# EasyEDA schematic Schematic_Central Unit for AgOpenGPS.json

## Sheets
1 Supply_USB: TITLE: Supply & USB; REV: 1.9; Date: 2020-12-11; Sheet: 1/1; Drawn By: GoRoNb; Company: agopengps.discourse.group
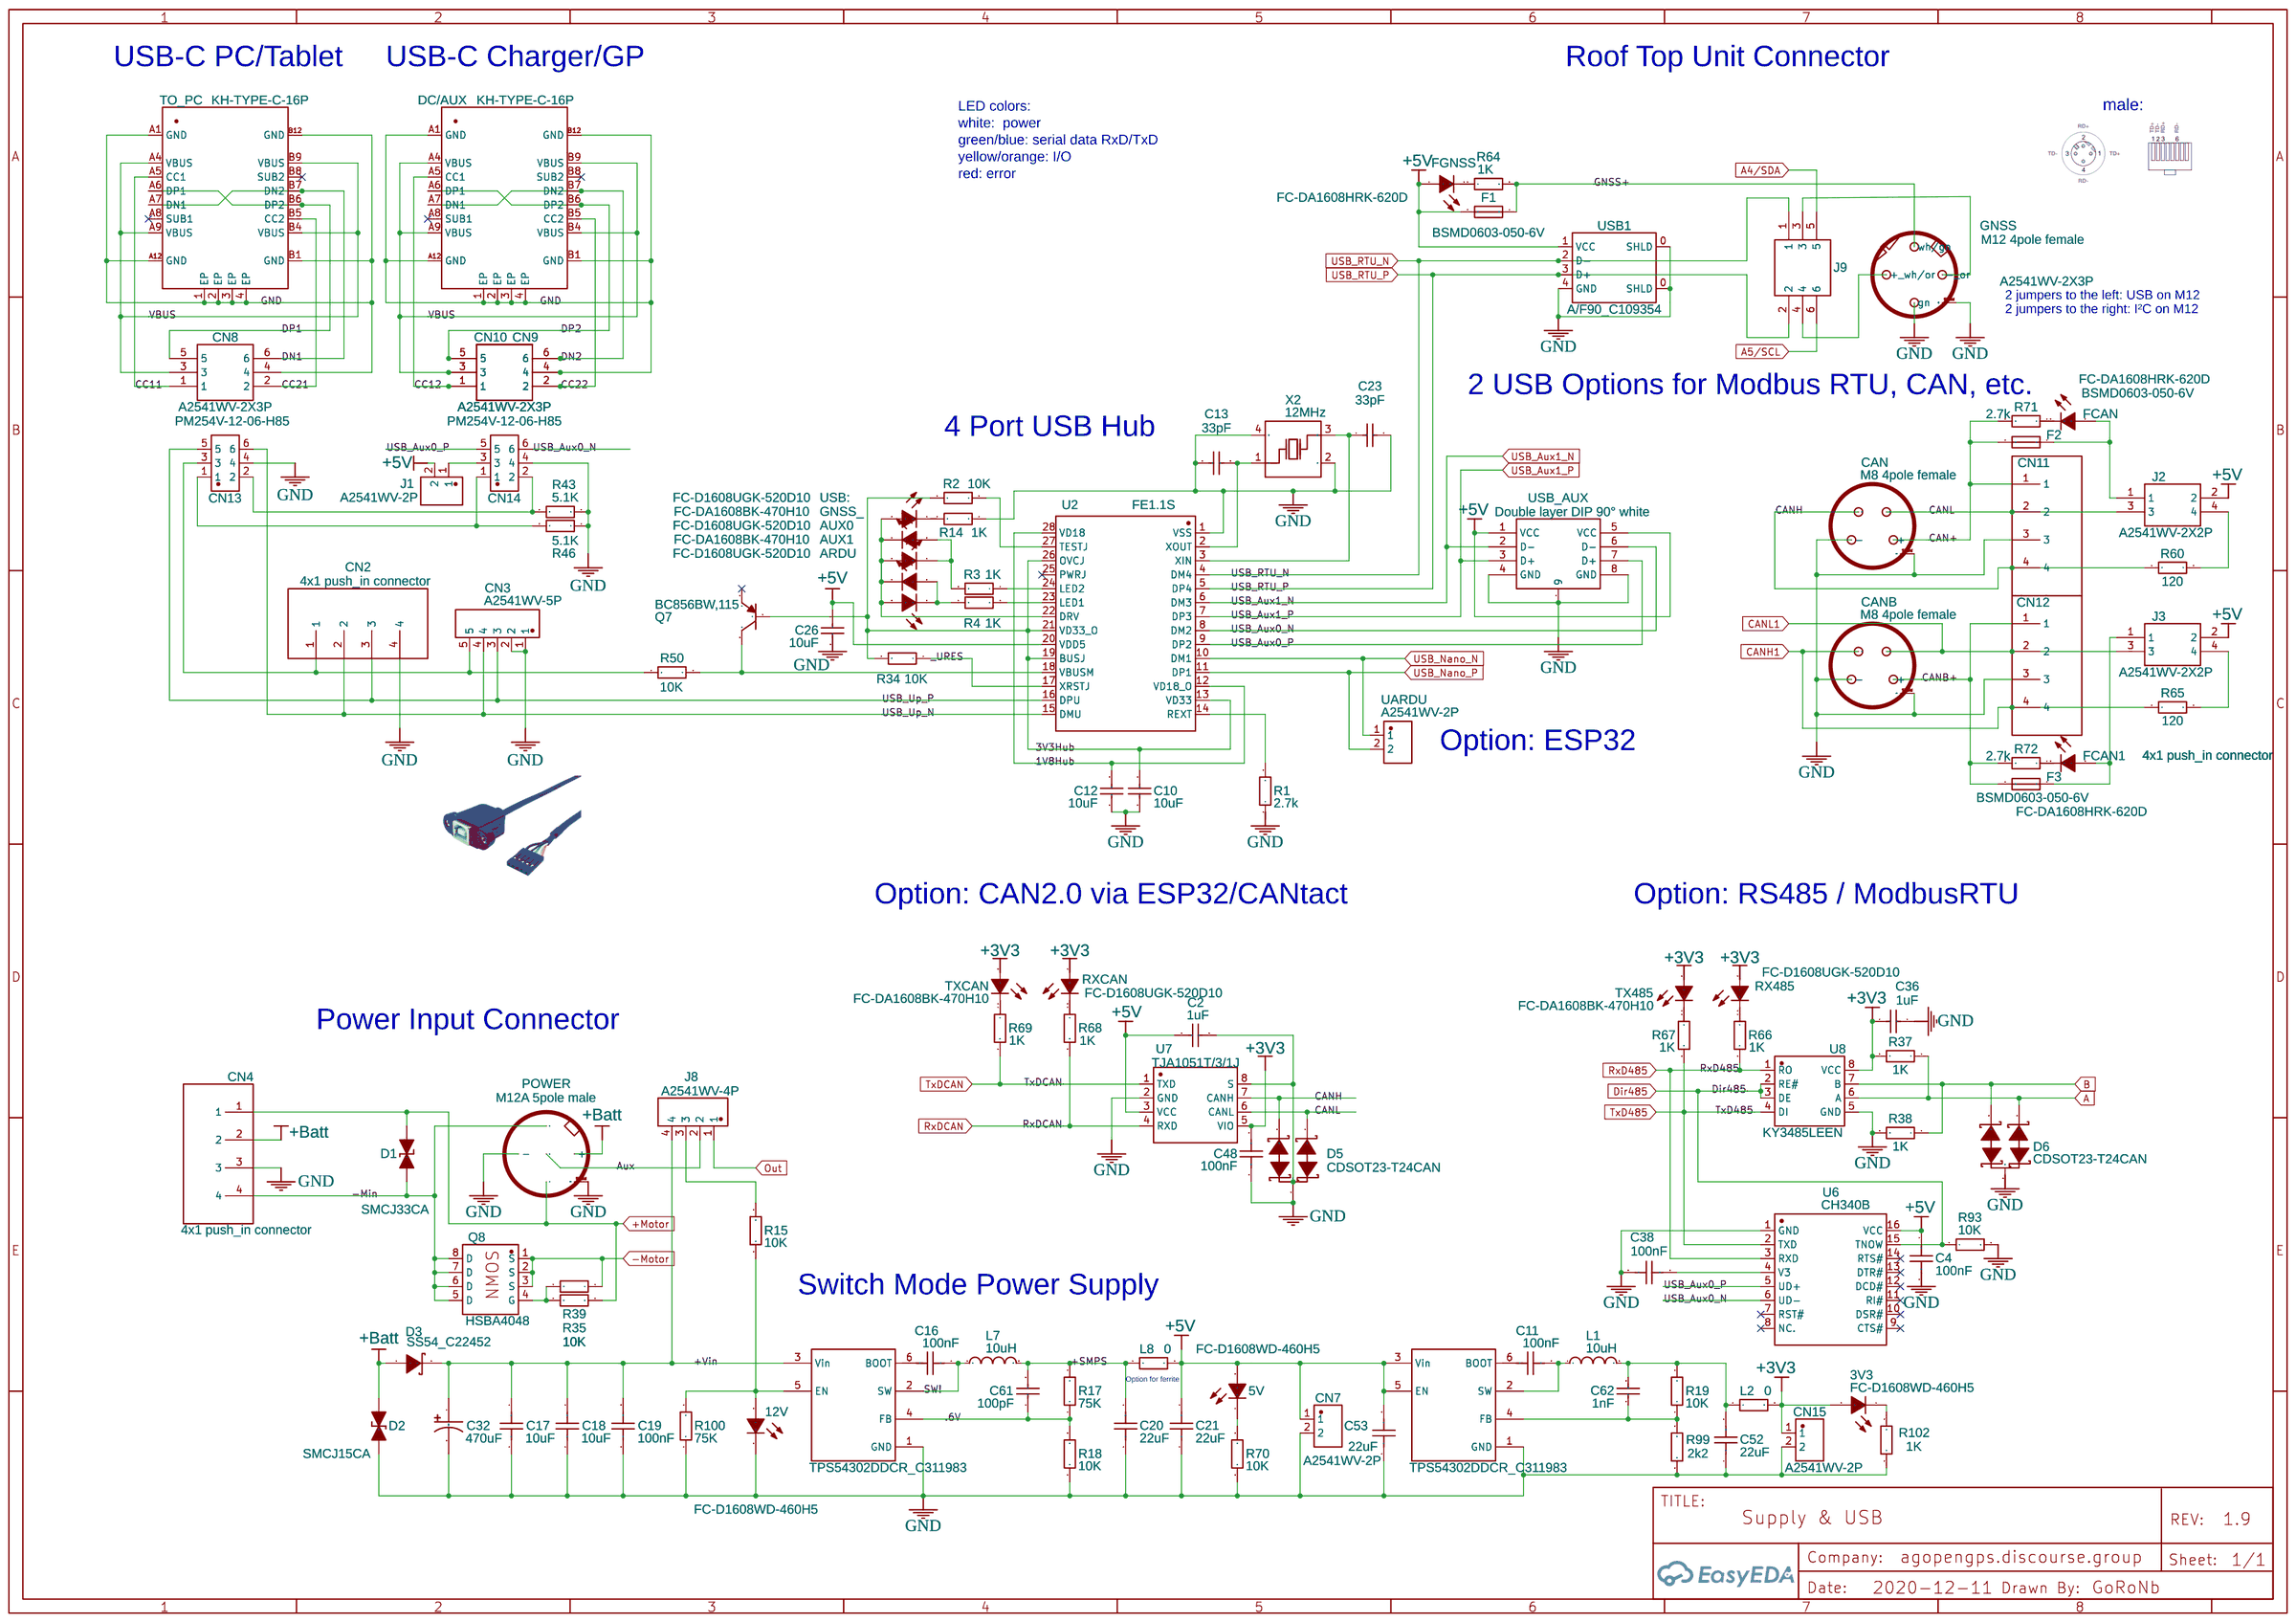
[diagram p0: Supply_USB]
2 Motor control: TITLE: µC, Motor Driver, I/O
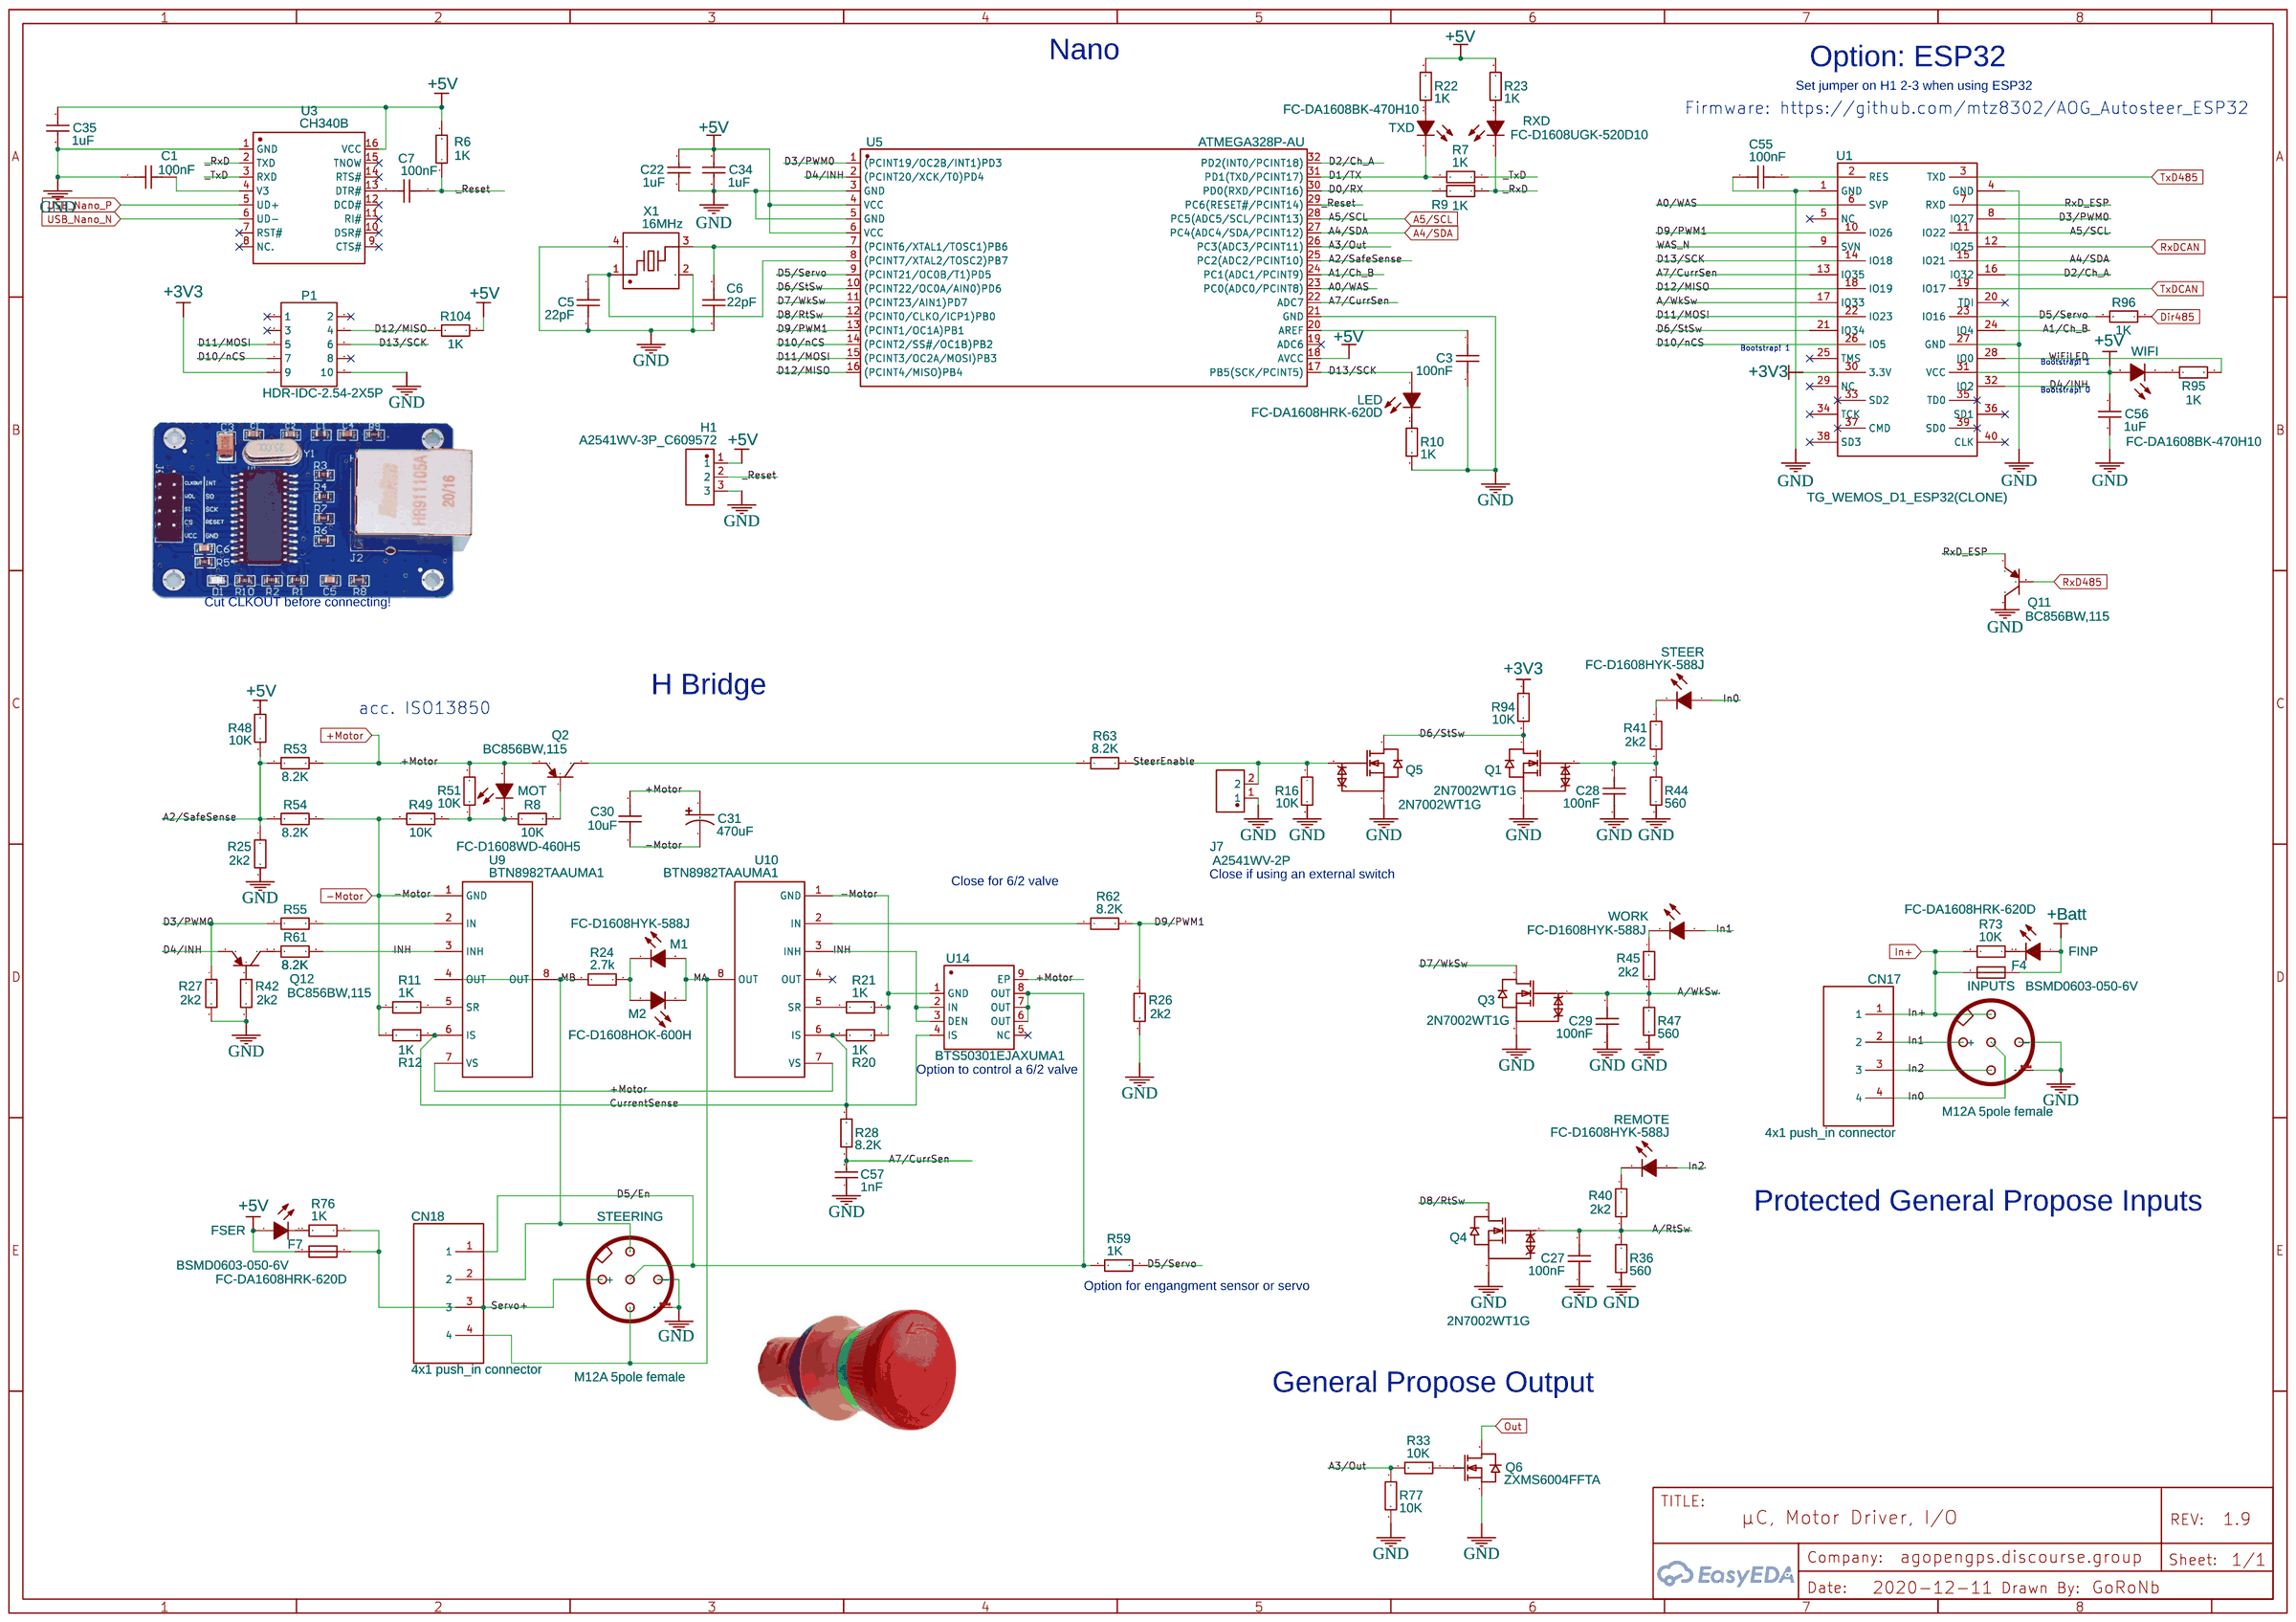
[diagram p1: Motor control]
3 CANtact: TITLE: CANtact controller
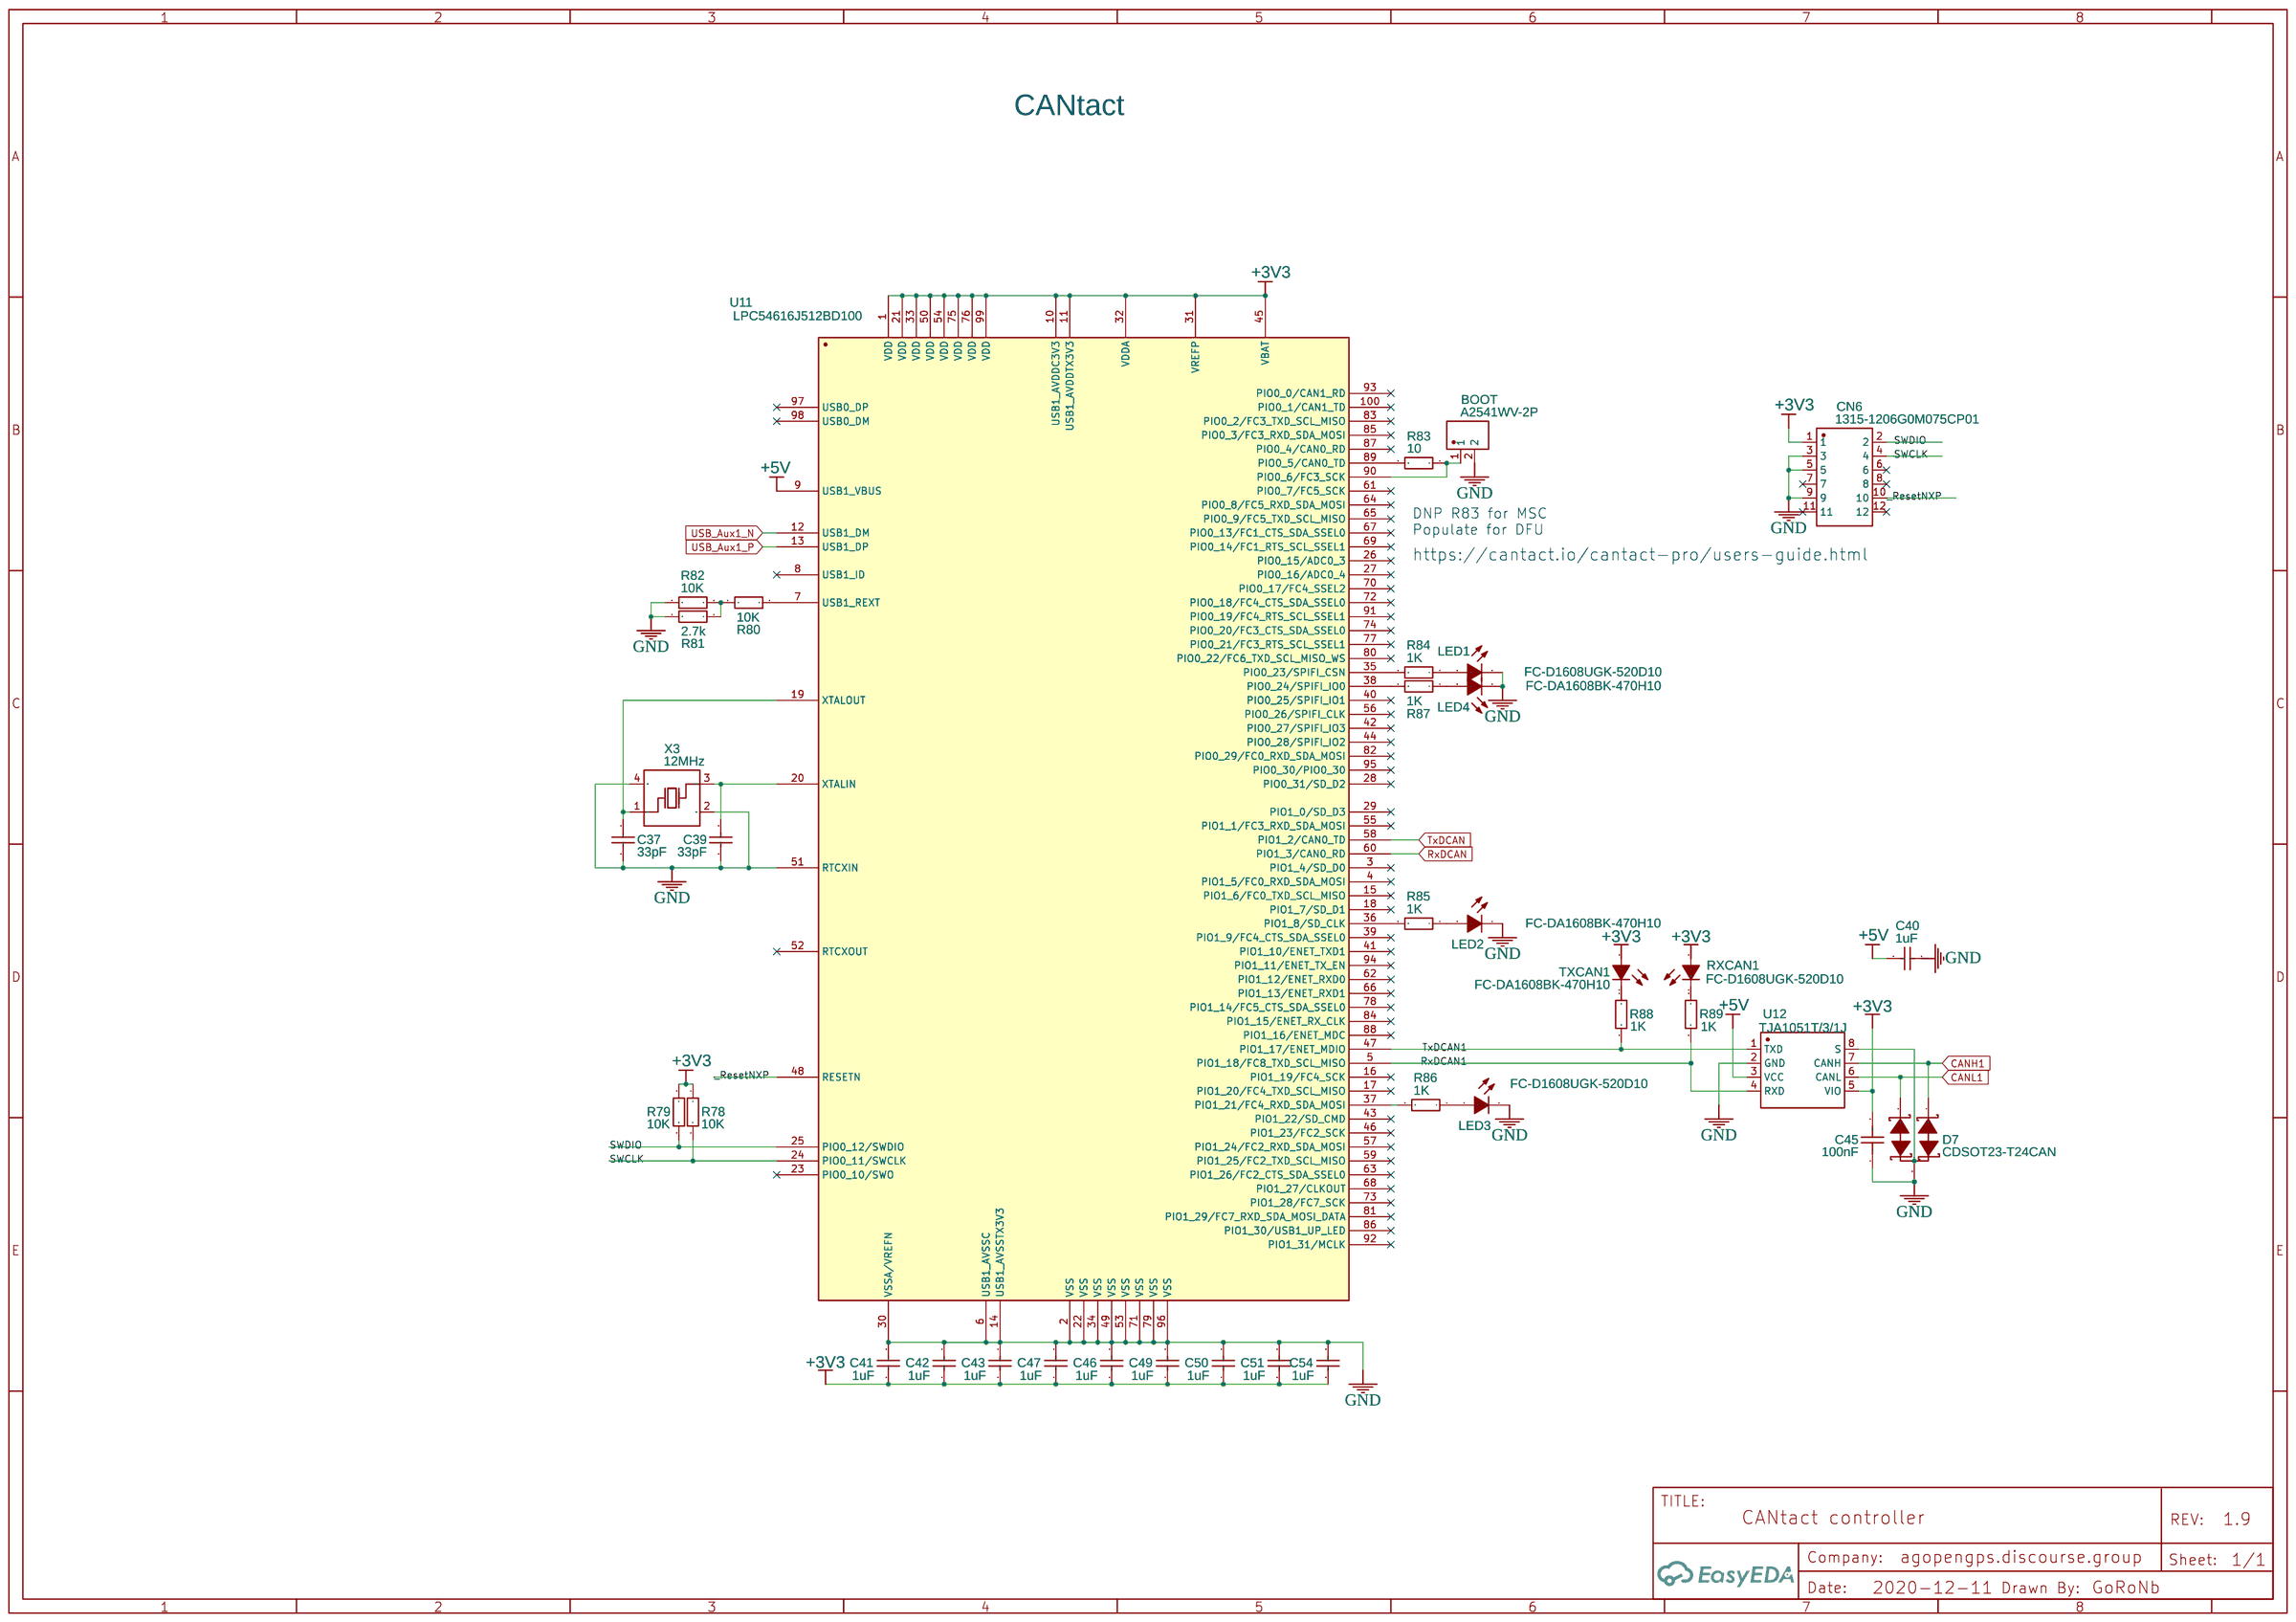
[diagram p2: CANtact]
4 Sensors: TITLE: Sensors
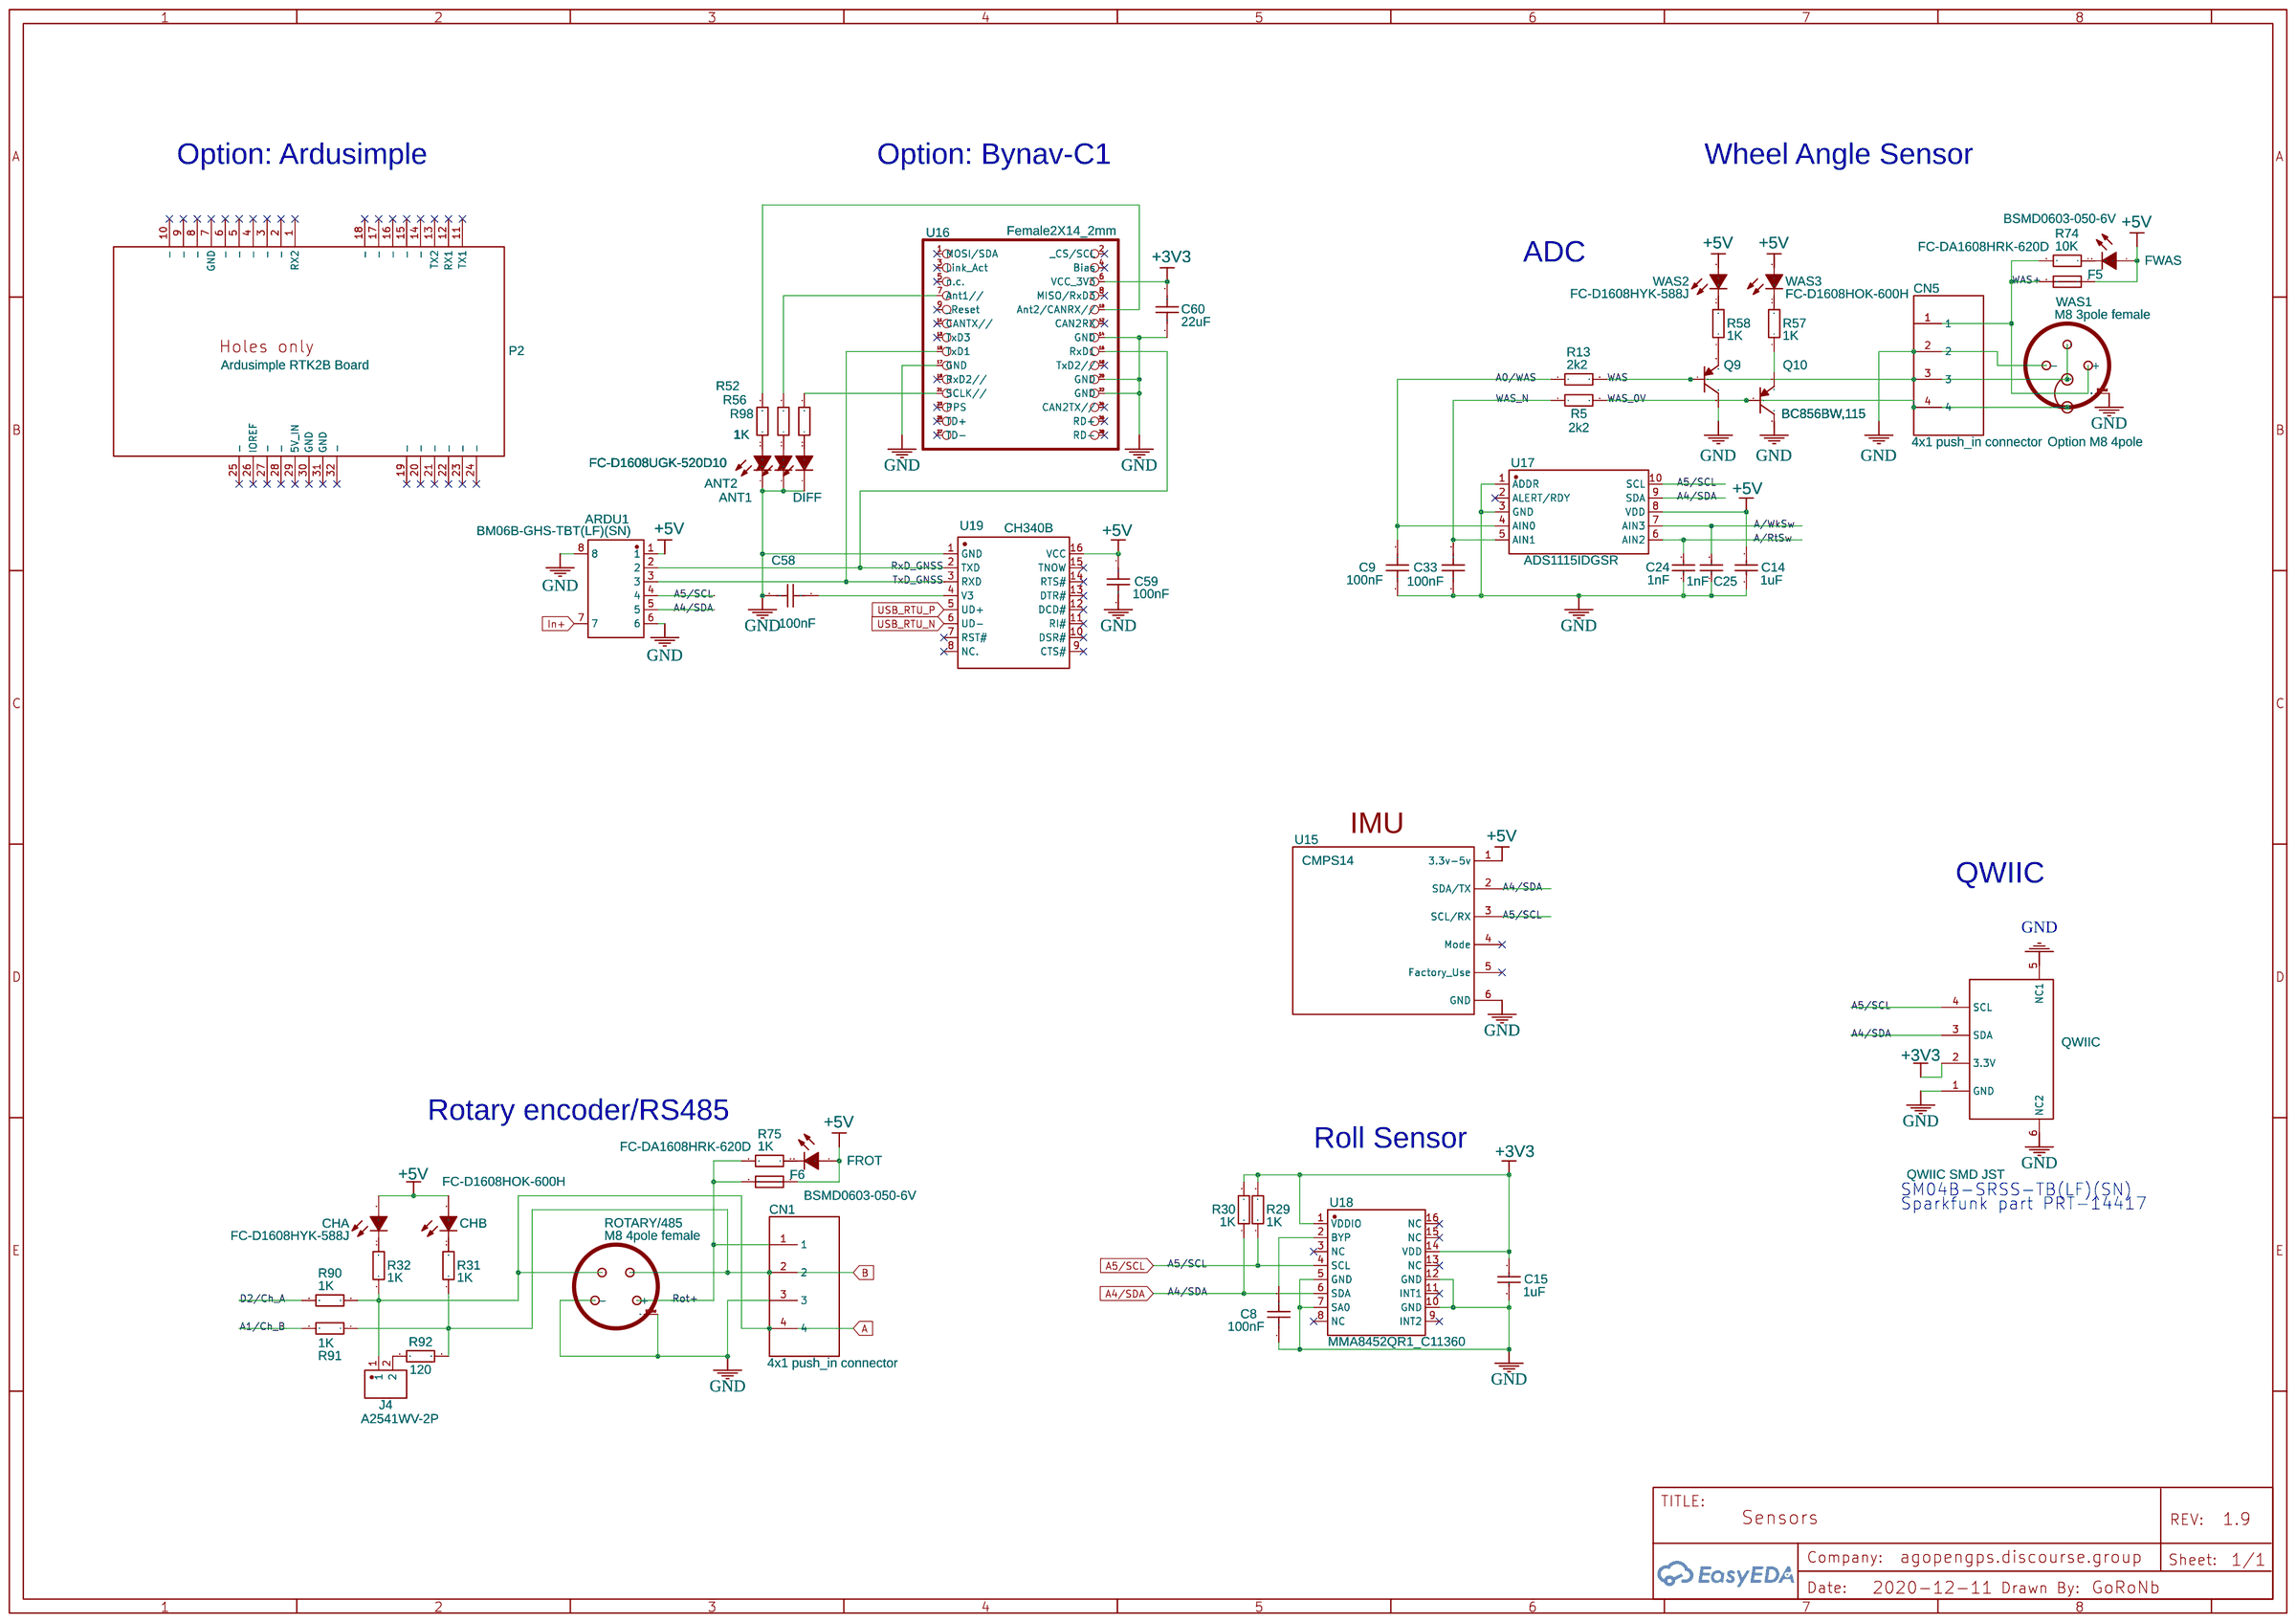
[diagram p3: Sensors]

## Parts
sheet CANtact
BOOT  A2541WV-2P  [HDR-TH_P2.54-H-M_A2541WV-2P]
C37  33pF  [C0603]
C39  33pF  [C0603]
C40  1uF  [C0603]
C41  1uF  [C0603]
C42  1uF  [C0603]
C43  1uF  [C0603]
C45  100nF  [C0603]
C46  1uF  [C0603]
C47  1uF  [C0603]
C49  1uF  [C0603]
C50  1uF  [C0603]
C51  1uF  [C0603]
C54  1uF  [C0603]
CN6  1315-1206G0M075CP01  [HDR-SMD_12P-P1.27-V-M-R2-C6-S7.50]
D7  CDSOT23-T24CAN  [SOT-23-3_L2.9-W1.3-P1.90-LS2.4-BR]
LED1  FC-D1608UGK-520D10  [LED0603-RD]
LED2  FC-DA1608BK-470H10  [LED0603-RD]
LED3  FC-D1608UGK-520D10  [LED0603-RD]
LED4  FC-DA1608BK-470H10  [LED0603-RD]
R78  10K  [R0603]
R79  10K  [R0603]
R80  10K  [R0603]
R81  2.7k  [R0603]
R82  10K  [R0603]
R83  10  [R0603]
R84  1K  [R0603]
R85  1K  [R0603]
R86  1K  [R0603]
R87  1K  [R0603]
R88  1K  [R0603]
R89  1K  [R0603]
RXCAN1  FC-D1608UGK-520D10  [LED0603-RD]
TXCAN1  FC-DA1608BK-470H10  [LED0603-RD]
U11  LPC54616J512BD100  [TQFP-100_14X14X05P]
U12  TJA1051T/3/1J  [SOIC-8_L4.9-W3.9-P1.27-LS6.0-BL]
X3  12MHz  [OSC-SMD_4P-L3.2-W2.5-BL]
sheet Motor control
C1  100nF  [C0603]
C3  100nF  [C0603]
C5  22pF  [C0603]
C6  22pF  [C0603]
C7  100nF  [C0603]
C22  1uF  [C0603]
C27  100nF  [C0603]
C28  100nF  [C0603]
C29  100nF  [C0603]
C30  10uF  [C1206]
C31  470uF  [CAP-SMD_BD10.0-L10.3-W10.3-FD]
C34  1uF  [C0603]
C35  1uF  [C0603]
C55  100nF  [C0603]
C56  1uF  [C0603]
C57  1nF  [C0603]
CN17  4x1 push_in connector  [S2C-SMT 3.50/04/180G 3.5SN BK RL]
CN18  4x1 push_in connector  [S2C-SMT 3.50/04/180G 3.5SN BK RL]
F4  BSMD0603-050-6V  [F0603]
F7  BSMD0603-050-6V  [F0603]
FINP  FC-DA1608HRK-620D  [LED0603-FD]
FSER  FC-DA1608HRK-620D  [LED0603-FD]
H1  A2541WV-3P_C609572  [HDR-TH_3P-P2.54-V-M]
INPUTS  M12A 5pole female  [M12-A FEMALE 4-5POLE 90°]
J7  A2541WV-2P  [HDR-TH_P2.54-H-M_A2541WV-2P]
LED  FC-DA1608HRK-620D  [LED0603-FD]
M1  FC-D1608HYK-588J  [LED0603-RD]
M2  FC-D1608HOK-600H  [LED0603-RD]
MOT  FC-D1608WD-460H5  [LED0603-RD]
P1  HDR-IDC-2.54-2X5P  [IDC-TH_10P-P2.54_C5665]
Q1  2N7002WT1G  [SOT-323-3_L2.0-W1.3-P1.30-LS2.1-BR]
Q2  BC856BW,115  [SOT-323-3_L2.2-W1.3-P1.30-LS2.2-BR]
Q3  2N7002WT1G  [SOT-323-3_L2.0-W1.3-P1.30-LS2.1-BR]
Q4  2N7002WT1G  [SOT-323-3_L2.0-W1.3-P1.30-LS2.1-BR]
Q5  2N7002WT1G  [SOT-323-3_L2.0-W1.3-P1.30-LS2.1-BR]
Q6  ZXMS6004FFTA  [SOT-23-3_L2.9-W1.6-P1.90-LS2.8-BR]
Q11  BC856BW,115  [SOT-323-3_L2.2-W1.3-P1.30-LS2.2-BR]
Q12  BC856BW,115  [SOT-323-3_L2.2-W1.3-P1.30-LS2.2-BR]
R6  1K  [R0603]
R7  1K  [R0603]
R8  10K  [R0603]
R9  1K  [R0603]
R10  1K  [R0603]
R11  1K  [R0603]
R12  1K  [R0603]
R16  10K  [R0603]
R20  1K  [R0603]
R21  1K  [R0603]
R22  1K  [R0603]
R23  1K  [R0603]
R24  2.7k  [R0603]
R25  2k2  [R0603]
R26  2k2  [R0603]
R27  2k2  [R0603]
R28  8.2K  [RES-SMD_L3.5-W1.5]
R33  10K  [R0603]
R36  560  [R0603]
R40  2k2  [R0603]
R41  2k2  [R0603]
R42  2k2  [R0603]
R44  560  [R0603]
R45  2k2  [R0603]
R47  560  [R0603]
R48  10K  [R0603]
R49  10K  [R0603]
R51  10K  [R0603]
R53  8.2K  [RES-SMD_L3.5-W1.5]
R54  8.2K  [RES-SMD_L3.5-W1.5]
R55  8.2K  [RES-SMD_L3.5-W1.5]
R59  1K  [R0603]
R61  8.2K  [RES-SMD_L3.5-W1.5]
R62  8.2K  [RES-SMD_L3.5-W1.5]
R63  8.2K  [RES-SMD_L3.5-W1.5]
R73  10K  [R0603]
R76  1K  [R0603]
R77  10K  [R0603]
R94  10K  [R0603]
R95  1K  [R0603]
R96  1K  [R0603]
R104  1K  [R0603]
REMOTE  FC-D1608HYK-588J  [LED0603-RD]
RXD  FC-D1608UGK-520D10  [LED0603-RD]
STEER  FC-D1608HYK-588J  [LED0603-RD]
STEERING  M12A 5pole female  [M12-A FEMALE 4-5POLE 90°]
TXD  FC-DA1608BK-470H10  [LED0603-RD]
U1  TG_WEMOS_D1_ESP32(CLONE)  [WEMOS-D1 ESP32]
U3  CH340B  [SOIC-16_L9.9-W3.9-P1.27-LS6.0-BL]
U5  ATMEGA328P-AU  [TQFP-32_L7.0-W7.0-P0.80-LS9.0-BL]
U9  BTN8982TAAUMA1  [TO-263-7_L10.2-W10.4-P1.27-LS14.4-B]
U10  BTN8982TAAUMA1  [TO-263-7_L10.2-W10.4-P1.27-LS14.4-B]
U14  BTS50301EJAXUMA1  [PG-DSO-8_L4.9-W3.9-P1.27-LS6.0-BL-EP]
WIFI  FC-DA1608BK-470H10  [LED0603-RD]
WORK  FC-D1608HYK-588J  [LED0603-RD]
X1  16MHz  [OSC-SMD_4P-L2.0-W1.6-BL]
sheet Sensors
ANT1  FC-D1608UGK-520D10  [LED0603-RD]
ANT2  FC-D1608UGK-520D10  [LED0603-RD]
ARDU1  BM06B-GHS-TBT(LF)(SN)  [CONN-TH_SM06B-GHS-TB-LF-SN]
C8  100nF  [C0603]
C9  100nF  [C0603]
C14  1uF  [C0603]
C15  1uF  [C0603]
C24  1nF  [C0603]
C25  1nF  [C0603]
C33  100nF  [C0603]
C58  100nF  [C0603]
C59  100nF  [C0603]
C60  22uF  [C0805]
CHA  FC-D1608HYK-588J  [LED0603-RD]
CHB  FC-D1608HOK-600H  [LED0603-RD]
CN1  4x1 push_in connector  [S2C-SMT 3.50/04/180G 3.5SN BK RL]
CN5  4x1 push_in connector  [S2C-SMT 3.50/04/180G 3.5SN BK RL]
DIFF  FC-D1608UGK-520D10  [LED0603-RD]
F5  BSMD0603-050-6V  [F0603]
F6  BSMD0603-050-6V  [F0603]
FROT  FC-DA1608HRK-620D  [LED0603-FD]
FWAS  FC-DA1608HRK-620D  [LED0603-FD]
J4  A2541WV-2P  [HDR-TH_P2.54-H-M_A2541WV-2P]
OP1  Option M8 4pole  [1X02]
P2  Ardusimple RTK2B Board  [ARDUSIMPLE_MECH]
Q9  BC856BW,115  [SOT-323-3_L2.2-W1.3-P1.30-LS2.2-BR]
Q10  BC856BW,115  [SOT-323-3_L2.2-W1.3-P1.30-LS2.2-BR]
QWIIC  QWIIC SMD JST  [QWIIC CONNECTOR]
R5  2k2  [R0603]
R13  2k2  [R0603]
R29  1K  [R0603]
R30  1K  [R0603]
R31  1K  [R0603]
R32  1K  [R0603]
R52  1K  [R0603]
R56  1K  [R0603]
R57  1K  [R0603]
R58  1K  [R0603]
R74  10K  [R0603]
R75  1K  [R0603]
R90  1K  [R0603]
R91  1K  [R0603]
R92  120  [R1206]
R98  1K  [R0603]
ROTARY/485  M8 4pole female  [M8 FEMALE 4POLE 90°]
U15  CMPS14  [CMPS14]
U16  Female2X14_2mm  [BYNAV_C1]
U17  ADS1115IDGSR  [MSOP-10_L3.0-W3.0-P0.50-LS5.0-BL]
U18  MMA8452QR1_C11360  [QFN-16_L3.0-W3.0-P0.50-TL_MMA8452QR1]
U19  CH340B  [SOIC-16_L9.9-W3.9-P1.27-LS6.0-BL]
WAS1  M8 3pole female  [M8 FEMALE 3POLE 90°]
WAS2  FC-D1608HYK-588J  [LED0603-RD]
WAS3  FC-D1608HOK-600H  [LED0603-RD]
sheet Supply_USB
3V3  FC-D1608WD-460H5  [LED0603-RD]
5V  FC-D1608WD-460H5  [LED0603-RD]
12V  FC-D1608WD-460H5  [LED0603-RD]
ARDU  FC-D1608UGK-520D10  [LED0603-RD]
AUX0  FC-D1608UGK-520D10  [LED0603-RD]
AUX1  FC-DA1608BK-470H10  [LED0603-RD]
C2  1uF  [C0603]
C4  100nF  [C0603]
C10  10uF  [C0805]
C11  100nF  [C0603]
C12  10uF  [C0805]
C13  33pF  [C0603]
C16  100nF  [C0603]
C17  10uF  [C1206]
C18  10uF  [C1206]
C19  100nF  [C0603]
C20  22uF  [C0805]
C21  22uF  [C0805]
C23  33pF  [C0603]
C26  10uF  [C0805]
C32  470uF  [CAP-SMD_BD10.0-L10.3-W10.3-FD]
C36  1uF  [C0603]
C38  100nF  [C0603]
C48  100nF  [C0603]
C52  22uF  [C0805]
C53  22uF  [C0805]
C61  100pF  [C0603]
C62  1nF  [C0603]
CAN  M8 4pole female  [M8 FEMALE 4POLE 90°]
CANB  M8 4pole female  [M8 FEMALE 4POLE 90°]
CN2  4x1 push_in connector  [S2C-SMT 3.50/04/180G 3.5SN BK RL]
CN3  A2541WV-5P  [HDR-TH_5P-P2.54-V]
CN4  4x1 push_in connector  [S2C-SMT 3.50/04/180G 3.5SN BK RL]
CN7  A2541WV-2P  [HDR-TH_P2.54-H-M_A2541WV-2P]
CN8  A2541WV-2X3P  [HDR-TH_6P-P2.54-V-R2-C3-S2.54_A2541WV-2X3P]
CN9  A2541WV-2X3P  [HDR-TH_6P-P2.54-V-R2-C3-S2.54_A2541WV-2X3P]
CN10  A2541WV-2X3P  [HDR-TH_6P-P2.54-V-R2-C3-S2.54_A2541WV-2X3P]
CN11  4x1 push_in connector  [S2C-SMT 3.50/04/180G 3.5SN BK RL]
CN12  4x1 push_in connector  [S2C-SMT 3.50/04/180G 3.5SN BK RL]
CN13  PM254V-12-06-H85  [HDR-TH_6P-P2.54-V-F-R2-C3-S2.54]
CN14  PM254V-12-06-H85  [HDR-TH_6P-P2.54-V-F-R2-C3-S2.54]
CN15  A2541WV-2P  [HDR-TH_P2.54-H-M_A2541WV-2P]
D1  SMCJ33CA  [SMC_L6.9-W5.9-LS7.9-BI]
D2  SMCJ15CA  [SMC_L6.9-W5.9-LS7.9-BI]
D3  SS54_C22452  [SMA_L4.4-W2.8-LS5.4-R-RD]
D5  CDSOT23-T24CAN  [SOT-23-3_L3.0-W1.7-P0.95-LS2.9-BR]
D6  CDSOT23-T24CAN  [SOT-23-3_L3.0-W1.7-P0.95-LS2.9-BR]
DC/AUX  KH-TYPE-C-16P  [USB-C-TH-16]
F1  BSMD0603-050-6V  [F0603]
F2  BSMD0603-050-6V  [F0603]
F3  BSMD0603-050-6V  [F0603]
FCAN  FC-DA1608HRK-620D  [LED0603-FD]
FCAN1  FC-DA1608HRK-620D  [LED0603-FD]
FGNSS  FC-DA1608HRK-620D  [LED0603-FD]
GNSS  M12 4pole female  [M12-D FEMALE 4POLE 90°]
GNSS_  FC-DA1608BK-470H10  [LED0603-RD]
J1  A2541WV-2P  [HDR-TH_P2.54-H-M_A2541WV-2P]
J2  A2541WV-2X2P  [HDR-TH_4P-P2.54-V-R2-C2-S2.54_A2541WV-2X2P]
J3  A2541WV-2X2P  [HDR-TH_4P-P2.54-V-R2-C2-S2.54_A2541WV-2X2P]
J8  A2541WV-4P  [HDR-TH_4P-P2.54-V]
J9  A2541WV-2X3P  [HDR-TH_6P-P2.54-V-R2-C3-S2.54_A2541WV-2X3P]
L1  10uH  [IND-SMD_L5.4-W5.2]
L2  0  [R0603]
L7  10uH  [IND-SMD_L5.4-W5.2]
L8  0  [R0603]
POWER  M12A 5pole male  [M12-A MALE 4-5POLE 90°]
Q7  BC856BW,115  [SOT-323-3_L2.2-W1.3-P1.30-LS2.2-BR]
Q8  HSBA4048  [POWERPAK-SO-8_L6.2-W5.2-P1.27-BR-EP]
R1  2.7k  [R0603]
R2  10K  [R0603]
R3  1K  [R0603]
R4  1K  [R0603]
R14  1K  [R0603]
R15  10K  [R0603]
R17  75K  [R0603]
R18  10K  [R0603]
R19  10K  [R0603]
R34  10K  [R0603]
R35  10K  [R0603]
R37  1K  [R0603]
R38  1K  [R0603]
R39  10K  [R0603]
R43  5.1K  [R0603]
R46  5.1K  [R0603]
R50  10K  [R0603]
R60  120  [R1206]
R64  1K  [R0603]
R65  120  [R1206]
R66  1K  [R0603]
R67  1K  [R0603]
R68  1K  [R0603]
R69  1K  [R0603]
R70  10K  [R0603]
R71  2.7k  [R0603]
R72  2.7k  [R0603]
R93  10K  [R0603]
R99  2k2  [R0603]
R100  75K  [R0603]
R102  1K  [R0603]
RX485  FC-D1608UGK-520D10  [LED0603-RD]
RXCAN  FC-D1608UGK-520D10  [LED0603-RD]
TO_PC  KH-TYPE-C-16P  [USB-C-TH-16]
TX485  FC-DA1608BK-470H10  [LED0603-RD]
TXCAN  FC-DA1608BK-470H10  [LED0603-RD]
U2  FE1.1S  [SSOP-28_L9.9-W3.9-P0.64-LS6.0-BL]
U4  TPS54302DDCR_C311983  [SOT-23-6_L2.9-W1.6-P0.95-LS2.8-BL]
U6  CH340B  [SOIC-16_L9.9-W3.9-P1.27-LS6.0-BL]
U7  TJA1051T/3/1J  [SOIC-8_L4.9-W3.9-P1.27-LS6.0-BL]
U8  KY3485LEEN  [SO-8_L4.9-W3.9-P1.27-LS5.9-BL]
U13  TPS54302DDCR_C311983  [SOT-23-6_L2.9-W1.6-P0.95-LS2.8-BL]
UARDU  A2541WV-2P  [HDR-TH_P2.54-H-M_A2541WV-2P]
USB1  A/F90_C109354  [USB-A-TH_USB-A-F-2]
USB:  FC-D1608UGK-520D10  [LED0603-RD]
USB_AUX  Double layer DIP 90° white  [USB-A-TH_USB-M-51]
X2  12MHz  [OSC-SMD_4P-L3.2-W2.5-BL]

## Library data of the parts
BOOT CN7 CN15 J1 J4 J7 UARDU = A2541WV-2P: Supplier: LCSC; Supplier Part: C225477; Manufacturer: CJT(Changjiang Connectors); Contributor: LCSC
C13 C23 C37 C39 = CC0603JRNPO9BN330: Supplier: LCSC; Manufacturer: SAMSUNG; Manufacturer Part: CL10C330JB8NNNC; Supplier Part: C1663
C2 C14 C15 C22 C34-C36 C40-C43 C46 C47 C49-C51 C54 C56 = CL10A105KP8NNNC: Supplier: LCSC; Manufacturer: SAMSUNG; Supplier Part: C26413
C1 C3 C4 C7-C9 C11 C16 C19 C27-C29 C33 C38 C45 C48 C55 C58 C59 = CC0603JRX7R8BB104: Supplier: LCSC; Supplier Part: C327087; Manufacturer: YAGEO; Contributor: LCSC
CN6 = 1315-1206G0M075CP01: Supplier: LCSC; Supplier Part: C721777; Manufacturer: Wcon; Contributor: LCSC
D5-D7 = CDSOT23-T24CAN: Supplier: LCSC; Supplier Part: C252430; Manufacturer: Yenji Elec; Contributor: LCSC; LCSC Assembly: Yes; SMT Type: Extend
ANT1 ANT2 ARDU AUX0 DIFF LED1 LED3 RX485 RXCAN RXCAN1 RXD USB: = FC-D1608UGK-520D10: Supplier: LCSC; Manufacturer: NATIONSTAR; image: //image.lceda.cn/szlcsc/C84267.jpg; Supplier Part: C84267; SMT Type: Extend; JLCPCB SMD: Yes
AUX1 GNSS_ LED2 LED4 TX485 TXCAN TXCAN1 TXD WIFI = FC-DA1608BK-470H10: Supplier: LCSC; Manufacturer: NATIONSTAR; image: //image.lceda.cn/szlcsc/C84266.jpg; Supplier Part: C84266; JLCPCB SMD: Yes
R2 R8 R15 R16 R18 R19 R33-R35 R39 R48-R51 R70 R73 R74 R77-R80 R82 R93 R94 = RTT03103JTP: Supplier: LCSC; Manufacturer: RALEC; Supplier Part: C103210
R1 R24 R71 R72 R81 = RTT03473JTP: Supplier: LCSC; Manufacturer: RALEC; Manufacturer Part: RTT03272JTP
R83 = RTT03100JTP: Supplier: LCSC; Manufacturer: RALEC; Supplier Part: C103203
R3 R4 R14 R29 R30 R37 R38 R64 R66-R69 R84-R89 R102 = RTT03102JTP: Supplier: LCSC; Manufacturer: RALEC; Supplier Part: C103209
U11 = LPC54616J512BD100: Supplier Part: 568-13457-ND; Supplier: Digi-Key; link: https://www.nxp.com/docs/en/data-sheet/LPC546XX.pdf; Contributor: arkkar
U7 U12 = TJA1051T/3/1J: Supplier: LCSC; Manufacturer: NXP; image: //image.lceda.cn/szlcsc/C38695.jpg; Supplier Part: C38695; SMT Type: Basic; JLCPCB SMD: Yes; LCSC Assembly: Yes
X2 X3 = X322512MSB4SI: Supplier: LCSC; Manufacturer: YXC; Supplier Part: C9002; SMT Type: Basic; JLCPCB SMD: Yes
C5 C6 = TCC0603COG220J500CT: Supplier: LCSC; Supplier Part: C376775; Manufacturer: CCTC; Contributor: LCSC
C17 C18 C30 = TCC1206X7R106K250HT: Supplier: LCSC; Supplier Part: C380364; Manufacturer: CCTC; Contributor: LCSC
C31 C32 = RT1E471M1010: Supplier: LCSC; Supplier Part: C59924; Manufacturer: CapXon; Manufacturer Part: HV471M016F105R; Contributor: LCSC
C24 C25 C57 C62 = 0603CG102F500NT: Supplier: LCSC; Supplier Part: C507408; Manufacturer: FH(Guangdong Fenghua Advanced Tech); Contributor: LCSC
CN1 CN2 CN4 CN5 CN11 CN12 CN17 CN18 = 4x1 push_in connector: Manufacturer: Weidmuller; Manufacturer Part: 1825660000; Supplier: Digi-Key; Supplier Part: 281-2044-ND; link: https://www.digikey.ca/product-detail/en/weidmuller/1825660000/281-2044-ND/1094382; Contributor: Renaud Varin
F1-F7 = BSMD0603-050-6V: Supplier: LCSC; Supplier Part: C883095; Manufacturer: BHFUSE; Contributor: LCSC
FCAN FCAN1 FGNSS FINP FROT FSER FWAS LED = FC-DA1608HRK-620D: Supplier: LCSC; Manufacturer: NATIONSTAR; Supplier Part: C84263
H1 = A2541WV-3P_C609572: Supplier: LCSC; Supplier Part: C609572; Manufacturer: CJT(Changjiang Connectors); Manufacturer Part: A2541WV-3P; Contributor: LCSC; LCSC Assembly: Yes; SMT Type: Extend; Paste Type: expand
INPUTS STEERING = M12A 5pole female: Manufacturer: Binder, Escha; Supplier: Digi-Key; Contributor: GoRoNb
CHA M1 REMOTE STEER WAS2 WORK = FC-D1608HYK-588J: Supplier: LCSC; Manufacturer: NATIONSTAR; Supplier Part: C84268; SMT Type: Extend; JLCPCB SMD: Yes
CHB M2 WAS3 = FC-D1608HOK-600H: Supplier: LCSC; Manufacturer: NATIONSTAR; Supplier Part: C84269; SMT Type: Extend; JLCPCB SMD: Yes
3V3 5V 12V MOT = FC-D1608WD-460H5: Supplier: LCSC; Manufacturer: NATIONSTAR; Supplier Part: C84265; SMT Type: Extend; JLCPCB SMD: Yes
P1 = HDR-IDC-2.54-2X5P: Supplier: LCSC; Manufacturer: BOOMELE; Manufacturer Part: IDC Box 2.54mm 2X5P; image: //image.lceda.cn/szlcsc/C5665.jpg; Supplier Part: C5665; LCSC Assembly: Yes; SMT Type: Extend
Q1 Q3-Q5 = 2N7002WT1G: Supplier: LCSC; Supplier Part: C12778; Manufacturer: ON Semicon; Contributor: LCSC; SMT Type: Extend; JLCPCB SMD: Yes
Q2 Q7 Q9-Q12 = BC856BW,115: Supplier: LCSC; Manufacturer: Nexperia; image: //image.lceda.cn/szlcsc/C28063.jpg; Supplier Part: C28063; LCSC Assembly: Yes; SMT Type: Extend
Q6 = ZXMS6004FFTA: Supplier: LCSC; Supplier Part: C95063; Manufacturer: Diodes Incorporated; Contributor: LCSC
R6 R7 R9-R12 R20-R23 R31 R32 R52 R56-R59 R75 R76 R90 R91 R95 R96 R98 R104 = RTT03103JTP: Supplier: LCSC; Manufacturer: RALEC; Manufacturer Part: RTT03102JTP; Supplier Part: C103210
R5 R13 R25-R27 R40-R42 R45 R99 = RTT03100JTP: Supplier: LCSC; Manufacturer: RALEC; Manufacturer Part: RTT03222JTP; Supplier Part: C103203
R28 R53-R55 R61-R63 = MELF-MFR02041/4WS8.2KΩFT50: Supplier: LCSC; Supplier Part: C265574; Manufacturer: Thunder Component; Manufacturer Part: MElF-MFR02041/4WS130ΩFT50; Contributor: LCSC
R36 R44 R47 = RTT03561JTP: Supplier: LCSC; Manufacturer: RALEC; Supplier Part: C103717
U1 = TG_WEMOS_D1_ESP32(CLONE): Manufacturer Part: New SchematicLib; Contributor: John Archbold; Supplier Part: undefined
U3 U6 U19 = CH340B: Supplier: LCSC; Manufacturer: WCH; image: //image.lceda.cn/szlcsc/C81010.jpg; Supplier Part: C81010
U5 = ATMEGA328P-AU: Supplier: LCSC; Manufacturer: MICROCHIP; image: //image.lceda.cn/szlcsc/C14877.jpg; Supplier Part: C14877; SMT Type: Basic; JLCPCB SMD: Yes
U9 U10 = BTN8982TAAUMA1: Supplier: LCSC; Manufacturer: Infineon; Supplier Part: C74175
U14 = BTS50301EJAXUMA1: Supplier: LCSC; Supplier Part: C454924; Manufacturer: Infineon Technologies; Contributor: LCSC
X1 = TZ2315C: Supplier: LCSC; Supplier Part: C108156; Manufacturer: Yangxing Tech; Manufacturer Part: X201616MPB4SC; Contributor: LCSC
ARDU1 = SM06B-GHS-TB(LF)(SN): Supplier: LCSC; Supplier Part: C133065; Manufacturer: JST Sales America; Contributor: LCSC
C20 C21 C52 C53 C60 = CL21A226MAQNNNE: Supplier: LCSC; Manufacturer: SAMSUNG; Supplier Part: C45783; SMT Type: Basic; JLCPCB SMD: Yes
OP1 = JUMPER: Contributor: KiCad
P2 = Ardusimple RTK2B Board: sourceId: 1T5FDZYC8; Manufacturer: Ardusimple; Contributor: DiaZ0te
QWIIC = QWIIC SMD JST: Manufacturer: JST Sales America; Manufacturer Part: SM04B-SRSS-TB(LF)(SN); Supplier: LCSC; Supplier Part: C160404; link: https://www.sparkfun.com/products/14417; Contributor: donhagen
R60 R65 R92 = RTT06121JTP: Supplier: LCSC; Manufacturer: RALEC; Supplier Part: C104621
CAN CANB ROTARY/485 = M8 4pole female: Manufacturer: Binder, Escha; Supplier: Digi-Key; Contributor: GoRoNb
U15 = CMPS14: Contributor: FixyNeko
U16 = Female2X14_2mm: Contributor: GoRoNb
U17 = ADS1115IDGSR: Supplier: LCSC; Manufacturer: TI; image: //image.lceda.cn/szlcsc/C37593.jpg; Supplier Part: C37593; LCSC Assembly: Yes; SMT Type: Extend
U18 = MMA8452QR1_C11360: Supplier: LCSC; Manufacturer: FREESCALE; Manufacturer Part: MMA8452QR1; image: //image.lceda.cn/szlcsc/C11360.jpg; Supplier Part: C11360; LCSC Assembly: Yes; SMT Type: Extend
WAS1 = M8 3pole female: Manufacturer: Binder, Escha; Supplier: Digi-Key; Contributor: GoRoNb
C10 C12 C26 = 0805X106K100: Supplier: LCSC; Manufacturer: WTC; Supplier Part: C105505
C61 = CL10C101JB8NNNC: Supplier: LCSC; Manufacturer: SAMSUNG; Supplier Part: C14858; SMT Type: Basic; JLCPCB SMD: Yes; LCSC Assembly: Yes
CN3 = A2541WV-5P: Supplier: LCSC; Supplier Part: C225480; Manufacturer: Changjiang Connectors; Contributor: LCSC; LCSC Assembly: Yes; SMT Type: Extend; Assembly Type: manualWeld; Paste Type: expand
CN8-CN10 J9 = A2541WV-2X3P: Supplier: LCSC; Supplier Part: C225518; Manufacturer: Changjiang Connectors; Manufacturer Part: A2541WV-2x3P; Contributor: LCSC
CN13 CN14 = PM254V-12-06-H85: Supplier: LCSC; Supplier Part: C541853; Manufacturer: XFCN; Contributor: LCSC
D1 = SMCJ33CA_C310048: Supplier: LCSC; Supplier Part: C310048; Manufacturer: Brightking Elec (TAIWAN); Contributor: LCSC; SMT Type: Extend; JLCPCB SMD: Yes
D2 = SMCJ15CA_C310017: Supplier: LCSC; Supplier Part: C310017; Manufacturer: Brightking Elec (TAIWAN); Contributor: LCSC; SMT Type: Extend; JLCPCB SMD: Yes
D3 = SS54_C22452: Supplier: LCSC; Manufacturer Part: SS54; Manufacturer: MDD; image: //image.lceda.cn/szlcsc/C22452.jpg; Supplier Part: C22452; SMT Type: Basic; JLCPCB SMD: Yes
DC/AUX TO_PC = KH-TYPE-C-16P: Supplier: LCSC; Supplier Part: C709357; Manufacturer: Shenzhen Kinghelm Elec; Contributor: LCSC
GNSS = M12 4pole female: Manufacturer: Binder, Escha; Supplier: Digi-Key; Contributor: GoRoNb
J2 J3 = A2541WV-2X2P: Supplier: LCSC; Supplier Part: C225517; Manufacturer: Changjiang Connectors; Manufacturer Part: A2541WV-2x2P; Contributor: LCSC
J8 = A2541WV-4P: Supplier: LCSC; Supplier Part: C225479; Manufacturer: Changjiang Connectors; Contributor: LCSC
L1 L7 = MWSA0503-100MT: Supplier: LCSC; Manufacturer: Sunlord; Contributor: LCSC; Supplier Part: C139506; SMT Type: Extend; JLCPCB SMD: Yes; LCSC Assembly: Yes
L2 L8 = 0603WAF0000T5E: Supplier: LCSC; Manufacturer: UniOhm; Supplier Part: C21189; SMT Type: Basic; JLCPCB SMD: Yes; LCSC Assembly: Yes
POWER = M12A 5pole male: Manufacturer: Binder, Escha; Supplier: Digi-Key; Contributor: GoRoNb
Q8 = HSBA4048: Supplier: LCSC; Supplier Part: C508827; Manufacturer: HUASHUO; Contributor: LCSC; SMT Type: Extend; JLCPCB SMD: Yes
R17 R100 = 0603WAF7502T5E: Supplier: LCSC; Manufacturer: UniOhm; Supplier Part: C23242; SMT Type: Basic; JLCPCB SMD: Yes; LCSC Assembly: Yes
R43 R46 = 0603WAF5101T5E: Supplier: LCSC; Manufacturer: UniOhm; Supplier Part: C23186; SMT Type: Basic; JLCPCB SMD: Yes; LCSC Assembly: Yes
U2 = FE1.1S: Supplier: LCSC; Manufacturer: TERMINUS; image: //image.lceda.cn/szlcsc/C9359.jpg; Supplier Part: C9359; SMT Type: Extend; JLCPCB SMD: Yes
U4 U13 = TPS56339: Manufacturer: Texas Instruments; Manufacturer Part: TPS54302DDCR; Supplier: Texas Instruments; Supplier Part: C311983; link: http://www.ti.com/lit/ds/symlink/tps56339.pdf; Contributor: TheLastDroid
U8 = KY3485LEEN: Supplier: LCSC; Supplier Part: C428902; Manufacturer: Keysemi; Contributor: LCSC
USB1 = A/F90_C109354: Supplier: LCSC; Supplier Part: C109354; Manufacturer: LCSC; Contributor: 立创EDA官方封装库
USB_AUX = Double layer DIP 90° white: Supplier: LCSC; Manufacturer: ValuePro; Supplier Part: C2341

## Nets
1V8Hub: C12.2 U2.12(VD18_O) U2.28(VD18)
3V3Hub: C10.2 Q7.1 R2.2 R34.2 U2.13(VD33) U2.19(BUSJ) U2.21(VD33_O) U2.26(OVCJ)
+3V3: 3V3.2(+) C15.1 C36.1 C41.2 C42.2 C43.2 C45.2 C46.2 C47.2 C48.2 C49.2 C50.2 C51.2 C54.2 C60.2 CN6.1 CN15.1 L2.2 P1.9 QWIIC.2(3.3V) R29.2 R30.2 R37.2 R78.1 R79.1 R94.1 RX485.2(A) RXCAN.2(A) RXCAN1.2(A) TX485.2(+) TXCAN.2(+) TXCAN1.2(+) U1.30(3.3V) U7.5(VIO) U8.8(VCC) U11.1(VDD) U11.10(USB1_AVDDC3V3) U11.11(USB1_AVDDTX3V3) U11.21(VDD) U11.31(VREFP) U11.32(VDDA) U11.33(VDD) U11.45(VBAT) U11.50(VDD) U11.54(VDD) U11.75(VDD) U11.76(VDD) U11.99(VDD) U12.5(VIO) U16.6(VCC_3V3) U18.1(VDDIO) U18.14(VDD)
+5V: 5V.2(+) ARDU1.1 C2.1 C4.1 C14.1 C21.2 C22.1 C26.1 C34.1 C35.1 C40.1 C53.2 C56.1 C59.1 CHA.2(A) CHB.2(A) CN7.1 F1.2 F5.1 F6.1 F7.1 FGNSS.1(A) FROT.1(A) FSER.1(A) FWAS.1(A) H1.1 J1.2 J2.2 J3.2 L8.2 R6.2 R22.2 R23.2 R48.1 R104.1 U1.31(VCC) U2.20(VDD5) U3.16(VCC) U5.4(VCC) U5.6(VCC) U5.18(AVCC) U6.16(VCC) U7.3(VCC) U11.9(USB1_VBUS) U12.3(VCC) U13.3(Vin) U13.5(EN) U15.1(3.3v-5v) U17.8(VDD) U19.16(VCC) USB1.1(VCC) USB_AUX.1(VCC) USB_AUX.5(VCC) WAS2.2(A) WAS3.2(A) WIFI.2(+)
+Vin: C17.2 C18.2 C19.2 C32.1 D3.2(K) J8.4 U4.3(Vin)
GND: 12V.1(-) ANT1.1(K) ANT2.1(K) ARDU1.6 ARDU1.8 BOOT.2 C1.2 C2.2 C3.2 C4.2 C5.1 C6.1 C8.1 C9.1 C10.1 C12.1 C13.1 C14.2 C15.2 C17.1 C18.1 C19.1 C20.1 C21.1 C22.2 C23.2 C24.1 C25.1 C26.2 C27.1 C28.1 C29.1 C32.2 C33.1 C34.2 C35.2 C36.2 C37.1 C38.2 C39.1 C40.2 C41.1 C42.1 C43.1 C45.1 C46.1 C47.1 C48.1 C49.1 C50.1 C51.1 C52.1 C53.1 C54.1 C55.1 C56.2 C57.1 C58.2 C59.2 C60.1 CAN.3(-) CAN.Shield CANB.3(-) CANB.Shield CN1.3 CN2.4 CN3.1 CN3.2 CN4.3 CN5.2 CN6.3 CN6.5 CN6.9 CN7.2 CN8.4 CN9.4 CN10.4 CN11.3 CN12.3 CN13.4 CN14.4 CN15.2 D2.1(K) D5.3 D6.3 D7.3 DC/AUX.1(EP) DC/AUX.2(EP) DC/AUX.3(EP) DC/AUX.4(EP) DC/AUX.A1(GND) DC/AUX.A12(GND) DC/AUX.B1(GND) DC/AUX.B12(GND) DIFF.1(K) GNSS.4(gn) GNSS.Shield H1.3 INPUTS.3(-) INPUTS.Shield J7.1 LED1.1(K) LED2.1(-) LED3.1(K) LED4.1(-) P1.10 POWER.3(-) POWER.Shield Q1.2(S) Q3.2(S) Q4.2(S) Q5.2(S) Q6.2(S) Q9.3 Q10.3 Q11.3 QWIIC.1(GND) QWIIC.5(NC1) QWIIC.6(NC2) R1.1 R10.1 R14.1 R16.2 R18.1 R25.2 R26.2 R27.2 R36.1 R38.2 R42.2 R43.1 R44.1 R46.1 R47.1 R70.1 R77.2 R81.2 R82.2 R93.2 R99.2 R100.1 R102.2 ROTARY/485.3(-) ROTARY/485.Shield STEERING.3(-) STEERING.Shield TO_PC.1(EP) TO_PC.2(EP) TO_PC.3(EP) TO_PC.4(EP) TO_PC.A1(GND) TO_PC.A12(GND) TO_PC.B1(GND) TO_PC.B12(GND) U1.1(GND) U1.4(GND) U1.27(GND) U2.1(VSS) U3.1(GND) U4.1(GND) U5.3(GND) U5.5(GND) U5.21(GND) U6.1(GND) U7.2(GND) U7.8(S) U8.5(GND) U11.2(VSS) U11.6(USB1_AVSSC) U11.14(USB1_AVSSTX3V3) U11.22(VSS) U11.30(VSSA/VREFN) U11.34(VSS) U11.49(VSS) U11.51(RTCXIN) U11.53(VSS) U11.71(VSS) U11.79(VSS) U11.96(VSS) U12.2(GND) U12.8(S) U13.1(GND) U15.6(GND) U16.14(GND) U16.17(GND) U16.20(GND) U16.22(GND) U17.1(ADDR) U17.3(GND) U18.5(GND) U18.7(SA0) U18.10(GND) U18.12(GND) U19.1(GND) USB1.0(SHLD) USB1.4(GND) USB_AUX.4(GND) USB_AUX.8(GND) USB_AUX.9 WAS1.3(-) WAS1.Shield X1.2(GND) X1.4(GND) X2.2(GND) X2.4(GND) X3.2(GND) X3.4(GND)
VBUS: CN8.3 CN9.3 CN10.3 DC/AUX.A4(VBUS) DC/AUX.A9(VBUS) DC/AUX.B4(VBUS) DC/AUX.B9(VBUS) TO_PC.A4(VBUS) TO_PC.A9(VBUS) TO_PC.B4(VBUS) TO_PC.B9(VBUS)
+Batt: CN4.2 D2.2(A) D3.1(A) F4.1 FINP.1(A) POWER.1(+)
+Motor: C30.2 C31.1 CN4.1 D1.2(A) MOT.2(+) POWER.4 Q2.2 R35.1 R51.2 R53.2 U9.7(VS) U10.7(VS) U14.9(EP)
+SMPS: C20.2 C61.2 L7.2 L8.1 R17.2
-Min: CN4.4 D1.1(K) POWER.2 Q8.5(D) Q8.6(D) Q8.7(D) Q8.8(D)
-Motor: C30.1 C31.2 Q8.1(S) Q8.2(S) Q8.3(S) R11.1 R12.1 R20.2 R21.2 R39.1 R49.1 R54.2 U9.1(GND) U10.1(GND) U14.1(GND)
.6V: C61.1 R17.1 R18.2 U4.4(FB)
_Reset: C7.1 H1.2 R6.1 U5.29(PC6(RESET#/PCINT14))
_ResetNXP: CN6.10 U11.48(RESETN)
_RxD: R9.2 RXD.1(K) U3.2(TXD)
_TxD: R7.1 U3.3(RXD)
_URES: R34.1 U2.17(XRSTJ)
A: CN1.4 D6.1 J4.1 R32.1 R37.1 R90.1 ROTARY/485.4 U8.6(A)
A0/WAS: C9.2 R13.1 U1.6(SVP) U5.23(PC0(ADC0/PCINT8)) U17.4(AIN0)
A1/Ch_B: R91.2 U1.24(IO4) U5.24(PC1(ADC1/PCINT9))
A2/SafeSense: R25.1 R48.2 R53.1 R54.1 U5.25(PC2(ADC2/PCINT10))
A3/Out: R33.2 R77.1 U5.26(PC3(ADC3/PCINT11))
A4/SDA: ARDU1.5 J9.5 QWIIC.3(SDA) R30.1 U1.15(IO21) U5.27(PC4(ADC4/SDA/PCINT12)) U15.2(SDA/TX) U17.9(SDA) U18.6(SDA)
A5/SCL: ARDU1.4 J9.6 QWIIC.4(SCL) R29.1 U1.11(IO22) U5.28(PC5(ADC5/SCL/PCINT13)) U15.3(SCL/RX) U17.10(SCL) U18.4(SCL)
A7/CurrSen: C57.2 R28.1 U1.13(IO35) U5.22(ADC7)
A/RtSw: C24.2 C27.2 Q4.1(G) R36.2 R40.2 U17.6(AIN2)
A/WkSw: C25.2 C29.2 Q3.1(G) R45.2 R47.2 U1.17(IO33) U17.7(AIN3)
Aux: J8.2 POWER.5
B: CN1.2 D6.2 R31.1 R38.1 R91.1 R92.2 ROTARY/485.2 U8.7(B)
CAN+: CAN.1(+) CN11.1 F2.2 R71.2
CANB+: CANB.1(+) CN12.1 F3.2 R72.2
CANH: CAN.4 CN11.4 D5.2 R60.1 U7.7(CANH)
CANH1: CANB.4 CN12.4 D7.1 R65.1 U12.7(CANH)
CANL: CAN.2 CN11.2 D5.1 J2.3 U7.6(CANL)
CANL1: CANB.2 CN12.2 D7.2 J3.3 U12.6(CANL)
CC11: CN8.1 TO_PC.A5(CC1)
CC12: CN9.1 CN10.1 DC/AUX.A5(CC1)
CC21: CN8.2 TO_PC.B5(CC2)
CC22: CN9.2 CN10.2 DC/AUX.B5(CC2)
CurrentSense: R12.2 R20.1 R28.2 U9.6(IS) U10.6(IS) U14.4(IS)
D0/RX: R9.1 U5.30(PD0(RXD/PCINT16))
D1/TX: R7.2 TXD.1(-) U5.31(PD1(TXD/PCINT17))
D2/Ch_A: R90.2 U1.16(IO32) U5.32(PD2(INT0/PCINT18))
D3/PWM0: R27.1 R55.1 U1.8(IO27) U5.1((PCINT19/OC2B/INT1)PD3)
D4/INH: Q12.2 U1.32(IO2) U5.2((PCINT20/XCK/T0)PD4)
D5/En: CN18.1 R59.2 STEERING.5 U14.6(OUT) U14.7(OUT) U14.8(OUT)
D5/Servo: R59.1 R96.2 U1.23(IO16) U5.9((PCINT21/OC0B/T1)PD5)
D6/StSw: Q1.3(D) Q5.3(D) R94.2 U1.21(IO34) U5.10((PCINT22/OC0A/AIN0)PD6)
D7/WkSw: Q3.3(D) U5.11((PCINT23/AIN1)PD7)
D8/RtSw: Q4.3(D) U5.12((PCINT0/CLKO/ICP1)PB0)
D9/PWM1: R26.1 R62.2 U1.10(IO26) U5.13((PCINT1/OC1A)PB1)
D10/nCS: P1.7 U1.26(IO5) U5.14((PCINT2/SS#/OC1B)PB2)
D11/MOSI: P1.5 U1.22(IO23) U5.15((PCINT3/OC2A/MOSI)PB3)
D12/MISO: P1.4 R104.2 U1.18(IO19) U5.16((PCINT4/MISO)PB4)
D13/SCK: LED.1(A) P1.6 U1.14(IO18) U5.17(PB5(SCK/PCINT5))
Dir485: R93.1 R96.1 U6.15(TNOW) U8.2(RE#) U8.3(DE)
DN1: CN8.6 TO_PC.A7(DN1) TO_PC.B7(DN2)
DN2: CN9.6 CN10.6 DC/AUX.A7(DN1) DC/AUX.B7(DN2)
DP1: CN8.5 TO_PC.A6(DP1) TO_PC.B6(DP2)
DP2: CN9.5 CN10.5 DC/AUX.A6(DP1) DC/AUX.B6(DP2)
GNSS+: F1.1 GNSS.2(wh/gn) R64.2
In0: CN17.4 INPUTS.5 STEER.2(A)
In1: CN17.2 INPUTS.1(+) WORK.2(A)
In2: CN17.3 INPUTS.4 REMOTE.2(A)
In+: ARDU1.7 CN17.1 F4.2 INPUTS.2 R73.2
INH: R61.2 U9.3(INH) U10.3(INH) U14.2(IN) U14.3(DEN)
MA: CN18.4 M1.2(A) M2.1(K) STEERING.4 U10.8(OUT)
MB: CN18.2 R24.2 STEERING.2 U9.4(OUT) U9.8(OUT)
Out: J8.1 Q6.3(D)
Rot+: CN1.1 F6.2 R75.2 ROTARY/485.1(+)
RxD485: Q11.1 R66.2 U6.3(RXD) U8.1(RO)
RxD_ESP: Q11.2 U1.7(RXD)
RxD_GNSS: ARDU1.2 U16.16(RxD1) U19.2(TXD)
RxDCAN: R68.2 U1.12(IO25) U7.4(RXD) U11.60(PIO1_3/CAN0_RD)
RxDCAN1: R89.2 U11.5(PIO1_18/FC8_TXD_SCL_MISO) U12.4(RXD)
Servo+: CN18.3 F7.2 R76.1 STEERING.1(+)
SteerEnable: J7.2 Q5.1(G) R16.1 R63.2
SW!: C16.2 L7.1 U4.2(SW)
SWCLK: CN6.4 R78.2 U11.24(PIO0_11/SWCLK)
SWDIO: CN6.2 R79.2 U11.25(PIO0_12/SWDIO)
TxD485: R67.2 U1.3(TXD) U6.2(TXD) U8.4(DI)
TxD_GNSS: ARDU1.3 U16.15(TxD1) U19.3(RXD)
TxDCAN: R69.2 U1.19(IO17) U7.1(TXD) U11.58(PIO1_2/CAN0_TD)
TxDCAN1: R88.2 U11.47(PIO1_17/ENET_MDIO) U12.1(TXD)
USB_Aux0_N: CN14.6 U2.8(DM2) U6.6(UD-) USB_AUX.6(D-)
USB_Aux0_P: CN14.5 U2.9(DP2) U6.5(UD+) USB_AUX.7(D+)
USB_Aux1_N: U2.6(DM3) U11.12(USB1_DM) USB_AUX.2(D-)
USB_Aux1_P: U2.7(DP3) U11.13(USB1_DP) USB_AUX.3(D+)
USB_Nano_N: U2.10(DM1) U3.6(UD-) UARDU.1
USB_Nano_P: U2.11(DP1) U3.5(UD+) UARDU.2
USB_RTU_N: J9.1 U2.4(DM4) U19.6(UD-) USB1.2(D-)
USB_RTU_P: J9.2 U2.5(DP4) U19.5(UD+) USB1.3(D+)
USB_Up_N: CN2.2 CN3.4 CN13.6 U2.15(DMU)
USB_Up_P: CN2.3 CN3.3 CN13.5 U2.16(DPU)
WAS: CN5.3 OP1.1 Q9.1 R13.2 WAS1.4
WAS+: CN5.1 F5.2 R74.2 WAS1.1(+)
WAS_0V: CN5.4 OP1.2 Q10.1 R5.2
WAS_N: C33.2 R5.1 U1.9(SVN) U17.5(AIN1)
WiFiLED: R95.1 U1.28(IO0)
Net-(3V3-1): 3V3.1(-) R102.1
Net-(5V-1): 5V.1(-) R70.2
Net-(12V-2): 12V.2(+) R15.1 R100.2 U4.5(EN)
Net-(ANT1-2): ANT1.2(A) R56.1
Net-(ANT2-2): ANT2.2(A) R52.1
Net-(ARDU-1): ARDU.1(K) AUX1.2(+) R4.1
Net-(ARDU-2): ARDU.2(A) AUX0.2(A) AUX1.1(-) GNSS_.1(-) U2.22(DRV) USB:.2(A)
Net-(AUX0-1): AUX0.1(K) GNSS_.2(+) R3.2
Net-(BOOT-1): BOOT.1 R83.1 U11.90(PIO0_6/FC3_SCK)
Net-(C1-1): C1.1 U3.4(V3)
Net-(C3-1): C3.1 U5.20(AREF)
Net-(C5-2): C5.2 U5.8((PCINT7/XTAL2/TOSC2)PB7) X1.1
Net-(C6-2): C6.2 U5.7((PCINT6/XTAL1/TOSC1)PB6) X1.3
Net-(C7-2): C7.2 U3.13(DTR#)
Net-(C8-2): C8.2 U18.2(BYP)
Net-(C11-1): C11.1 U13.6(BOOT)
Net-(C11-2): C11.2 L1.1 U13.2(SW)
Net-(C13-2): C13.2 U2.2(XOUT) X2.1(OSC1)
Net-(C16-1): C16.1 U4.6(BOOT)
Net-(C23-1): C23.1 U2.3(XIN) X2.3(OSC2)
Net-(C28-2): C28.2 Q1.1(G) R41.2 R44.2
Net-(C37-2): C37.2 U11.19(XTALOUT) X3.1(OSC1)
Net-(C38-1): C38.1 U6.4(V3)
Net-(C39-2): C39.2 U11.20(XTALIN) X3.3(OSC2)
Net-(C52-2): C52.2 C62.2 L1.2 L2.1 R19.2
Net-(C55-2): C55.2 U1.2(RES)
Net-(C58-1): C58.1 U19.4(V3)
Net-(C62-1): C62.1 R19.1 R99.1 U13.4(FB)
Net-(CHA-1): CHA.1(K) R32.2
Net-(CHB-1): CHB.1(K) R31.2
Net-(CN2-1): CN2.1 CN3.5 CN13.3 R50.1
Net-(CN13-1): CN13.1 CN14.1 R46.2
Net-(CN13-2): CN13.2 CN14.2 R43.2
Net-(CN14-3): CN14.3 J1.1
Net-(DIFF-2): DIFF.2(A) R98.1
Net-(F2-1): F2.1 FCAN.1(A) J2.1
Net-(F3-1): F3.1 FCAN1.1(A) J3.1
Net-(FCAN1-2): FCAN1.2(K) R72.1
Net-(FCAN-2): FCAN.2(K) R71.1
Net-(FGNSS-2): FGNSS.2(K) R64.1
Net-(FINP-2): FINP.2(K) R73.1
Net-(FROT-2): FROT.2(K) R75.1
Net-(FSER-2): FSER.2(K) R76.2
Net-(FWAS-2): FWAS.2(K) R74.1
Net-(GNSS-1): GNSS.1(+ wh/or) J9.4
Net-(GNSS-3): GNSS.3(- or) J9.3
Net-(J2-4): J2.4 R60.2
Net-(J3-4): J3.4 R65.2
Net-(J4-2): J4.2 R92.1
Net-(J8-3): J8.3 R15.2
Net-(LED1-2): LED1.2(A) R84.1
Net-(LED2-2): LED2.2(+) R85.1
Net-(LED3-2): LED3.2(A) R86.1
Net-(LED4-2): LED4.2(+) R87.1
Net-(LED-2): LED.2(K) R10.2
Net-(M1-1): M1.1(K) M2.2(A) R24.1
Net-(MOT-1): MOT.1(-) R8.1 R49.2 R51.1
Net-(Q2-1): Q2.1 R8.2
Net-(Q2-3): Q2.3 R63.1
Net-(Q6-1): Q6.1(G) R33.1
Net-(Q7-3): Q7.3 R50.2 U2.18(VBUSM)
Net-(Q8-4): Q8.4(G) R35.2 R39.2
Net-(Q9-2): Q9.2 R58.1
Net-(Q10-2): Q10.2 R57.1
Net-(Q12-1): Q12.1 R42.1
Net-(Q12-3): Q12.3 R61.1
Net-(R1-2): R1.2 U2.14(REXT)
Net-(R2-1): R2.1 U2.27(TESTJ)
Net-(R3-1): R3.1 U2.24(LED2)
Net-(R4-2): R4.2 U2.23(LED1)
Net-(R11-2): R11.2 U9.5(SR)
Net-(R14-2): R14.2 USB:.1(K)
Net-(R21-1): R21.1 U10.5(SR)
Net-(R22-1): R22.1 TXD.2(+)
Net-(R23-1): R23.1 RXD.2(A)
Net-(R40-1): R40.1 REMOTE.1(K)
Net-(R41-1): R41.1 STEER.1(K)
Net-(R45-1): R45.1 WORK.1(K)
Net-(R52-2): R52.2 U16.10(Ant2/CANRX//)
Net-(R55-2): R55.2 U9.2(IN)
Net-(R56-2): R56.2 U16.7(Ant1//)
Net-(R57-2): R57.2 WAS3.1(K)
Net-(R58-2): R58.2 WAS2.1(K)
Net-(R62-1): R62.1 U10.2(IN)
Net-(R66-1): R66.1 RX485.1(K)
Net-(R67-1): R67.1 TX485.1(-)
Net-(R68-1): R68.1 RXCAN.1(K)
Net-(R69-1): R69.1 TXCAN.1(-)
Net-(R80-1): R80.1 U11.7(USB1_REXT)
Net-(R80-2): R80.2 R81.1 R82.1
Net-(R83-2): R83.2 U11.89(PIO0_5/CAN0_TD)
Net-(R84-2): R84.2 U11.35(PIO0_23/SPIFI_CSN)
Net-(R85-2): R85.2 U11.36(PIO1_8/SD_CLK)
Net-(R86-2): R86.2 U11.37(PIO1_21/FC4_RXD_SDA_MOSI)
Net-(R87-2): R87.2 U11.38(PIO0_24/SPIFI_IO0)
Net-(R88-1): R88.1 TXCAN1.1(-)
Net-(R89-1): R89.1 RXCAN1.1(K)
Net-(R95-2): R95.2 WIFI.1(-)
Net-(R98-2): R98.2 U16.21(SCLK//)

Not connected (* = marked no-connect by the designer): CN6 6* 7* 8* 11* 12*; DC/AUX A8(SUB1)* B8(SUB2)*; P1 1* 2* 3* 8*; P2 1(RX2)* 2(-)* 3(-)* 4(-)* 5(-)* 6(-)* 7(GND)* 8(-)* 9(-)* 10(-)* 11(TX1)* 12(RX1)* 13(TX2)* 14(-)* 15(-)* 16(-)* 17(-)* 18(-)* 19(-)* 20(-)* 21(-)* 22(-)* 23(-)* 24(-)* 25(-)* 26(IOREF)* 27(-)* 28(-)* 29(5V_IN)* 30(GND)* 31(GND)* 32(-)*; Q7 2*; TO_PC A8(SUB1)* B8(SUB2)*; U1 5(NC)* 20(TDI)* 25(TMS)* 29(NC)* 33(SD2)* 34(TCK)* 35(TD0)* 36(SD1)* 37(CMD)* 38(SD3)* 39(SD0)* 40(CLK)*; U2 25(PWRJ)*; U3 7(RST#)* 8(NC.)* 9(CTS#)* 10(DSR#)* 11(RI#)* 12(DCD#)* 14(RTS#)* 15(TNOW)*; U5 19(ADC6)*; U6 7(RST#)* 8(NC.)* 9(CTS#)* 10(DSR#)* 11(RI#)* 12(DCD#)* 13(DTR#)* 14(RTS#)*; U10 4(OUT)*; U11 3(PIO1_4/SD_D0)* 4(PIO1_5/FC0_RXD_SDA_MOSI)* 8(USB1_ID)* 15(PIO1_6/FC0_TXD_SCL_MISO)* 16(PIO1_19/FC4_SCK)* 17(PIO1_20/FC4_TXD_SCL_MISO)* 18(PIO1_7/SD_D1)* 23(PIO0_10/SWO)* 26(PIO0_15/ADC0_3)* 27(PIO0_16/ADC0_4)* 28(PIO0_31/SD_D2)* 29(PIO1_0/SD_D3)* 39(PIO1_9/FC4_CTS_SDA_SSEL0)* 40(PIO0_25/SPIFI_IO1)* 41(PIO1_10/ENET_TXD1)* 42(PIO0_27/SPIFI_IO3)* 43(PIO1_22/SD_CMD)* 44(PIO0_28/SPIFI_IO2)* 46(PIO1_23/FC2_SCK)* 52(RTCXOUT)* 55(PIO1_1/FC3_RXD_SDA_MOSI)* 56(PIO0_26/SPIFI_CLK)* 57(PIO1_24/FC2_RXD_SDA_MOSI)* 59(PIO1_25/FC2_TXD_SCL_MISO)* 61(PIO0_7/FC5_SCK)* 62(PIO1_12/ENET_RXD0)* 63(PIO1_26/FC2_CTS_SDA_SSEL0)* 64(PIO0_8/FC5_RXD_SDA_MOSI)* 65(PIO0_9/FC5_TXD_SCL_MISO)* 66(PIO1_13/ENET_RXD1)* 67(PIO0_13/FC1_CTS_SDA_SSEL0)* 68(PIO1_27/CLKOUT)* 69(PIO0_14/FC1_RTS_SCL_SSEL1)* 70(PIO0_17/FC4_SSEL2)* 72(PIO0_18/FC4_CTS_SDA_SSEL0)* 73(PIO1_28/FC7_SCK)* 74(PIO0_20/FC3_CTS_SDA_SSEL0)* 77(PIO0_21/FC3_RTS_SCL_SSEL1)* 78(PIO1_14/FC5_CTS_SDA_SSEL0)* 80(PIO0_22/FC6_TXD_SCL_MISO_WS)* 81(PIO1_29/FC7_RXD_SDA_MOSI_DATA)* 82(PIO0_29/FC0_RXD_SDA_MOSI)* 83(PIO0_2/FC3_TXD_SCL_MISO)* 84(PIO1_15/ENET_RX_CLK)* 85(PIO0_3/FC3_RXD_SDA_MOSI)* 86(PIO1_30/USB1_UP_LED)* 87(PIO0_4/CAN0_RD)* 88(PIO1_16/ENET_MDC)* 91(PIO0_19/FC4_RTS_SCL_SSEL1)* 92(PIO1_31/MCLK)* 93(PIO0_0/CAN1_RD)* 94(PIO1_11/ENET_TX_EN)* 95(PIO0_30/PIO0_30)* 97(USB0_DP)* 98(USB0_DM)* 100(PIO0_1/CAN1_TD)*; U14 5(NC)*; U15 4(Mode)* 5(Factory Use)*; U16 1(MOSI/SDA)* 2(_CS/SCL)* 3(Link_Act)* 4(Bias)* 5(n.c.)* 8(MISO/RxD3)* 9(_Reset)* 11(CANTX//)* 12(CAN2RX)* 13(TxD3)* 18(TxD2//)* 19(RxD2//)* 23(PPS)* 24(CAN2TX//)* 25(TD+)* 26(RD+)* 27(TD-)* 28(RD-)*; U17 2(ALERT/RDY)*; U18 3(NC)* 8(NC)* 9(INT2)* 11(INT1)* 13(NC)* 15(NC)* 16(NC)*; U19 7(RST#)* 8(NC.)* 9(CTS#)* 10(DSR#)* 11(RI#)* 12(DCD#)* 13(DTR#)* 14(RTS#)* 15(TNOW)*

## Notes on the sheets
sheet 1
- USB-C PC/Tablet
- USB-C Charger/GP
- Roof Top Unit Connector
- LED colors:
  white:  power
  green/blue: serial data RxD/TxD
  yellow/orange: I/O
  red: error
- male:
- 2 jumpers to the left: USB on M12
- 2 jumpers to the right: I²C on M12
- 2 USB Options for Modbus RTU, CAN, etc.
- 4 Port USB Hub
- Option: ESP32
- Option: CAN2.0 via ESP32/CANtact
- Option: RS485 / ModbusRTU
- Power Input Connector
- Switch Mode Power Supply
- Option for ferrite
sheet 2
- Nano
- Option: ESP32
- Set jumper on H1 2-3 when using ESP32
- Firmware: https://github.com/mtz8302/AOG_Autosteer_ESP32
- Bootstrap! 1
- Bootstrap! 1
- Bootstrap! 0
- Cut CLKOUT before connecting!
- H Bridge
- acc. ISO13850
- Close if using an external switch
- Close for 6/2 valve
- Option to control a 6/2 valve
- Protected General Propose Inputs
- Option for engangment sensor or servo
- General Propose Output
sheet 3
- CANtact
- DNP R83 for MSC
  Populate for DFU
- https://cantact.io/cantact-pro/users-guide.html
sheet 4
- Option: Ardusimple
- Option: Bynav-C1
- Wheel Angle Sensor
- ADC
- QWIIC
- Rotary encoder/RS485
- Roll Sensor
- SM04B-SRSS-TB(LF)(SN)
- Sparkfunk part PRT-14417
